# EAGLE design H05R0 (EAGLE 9.6.1)

## Sheet 1 of 3
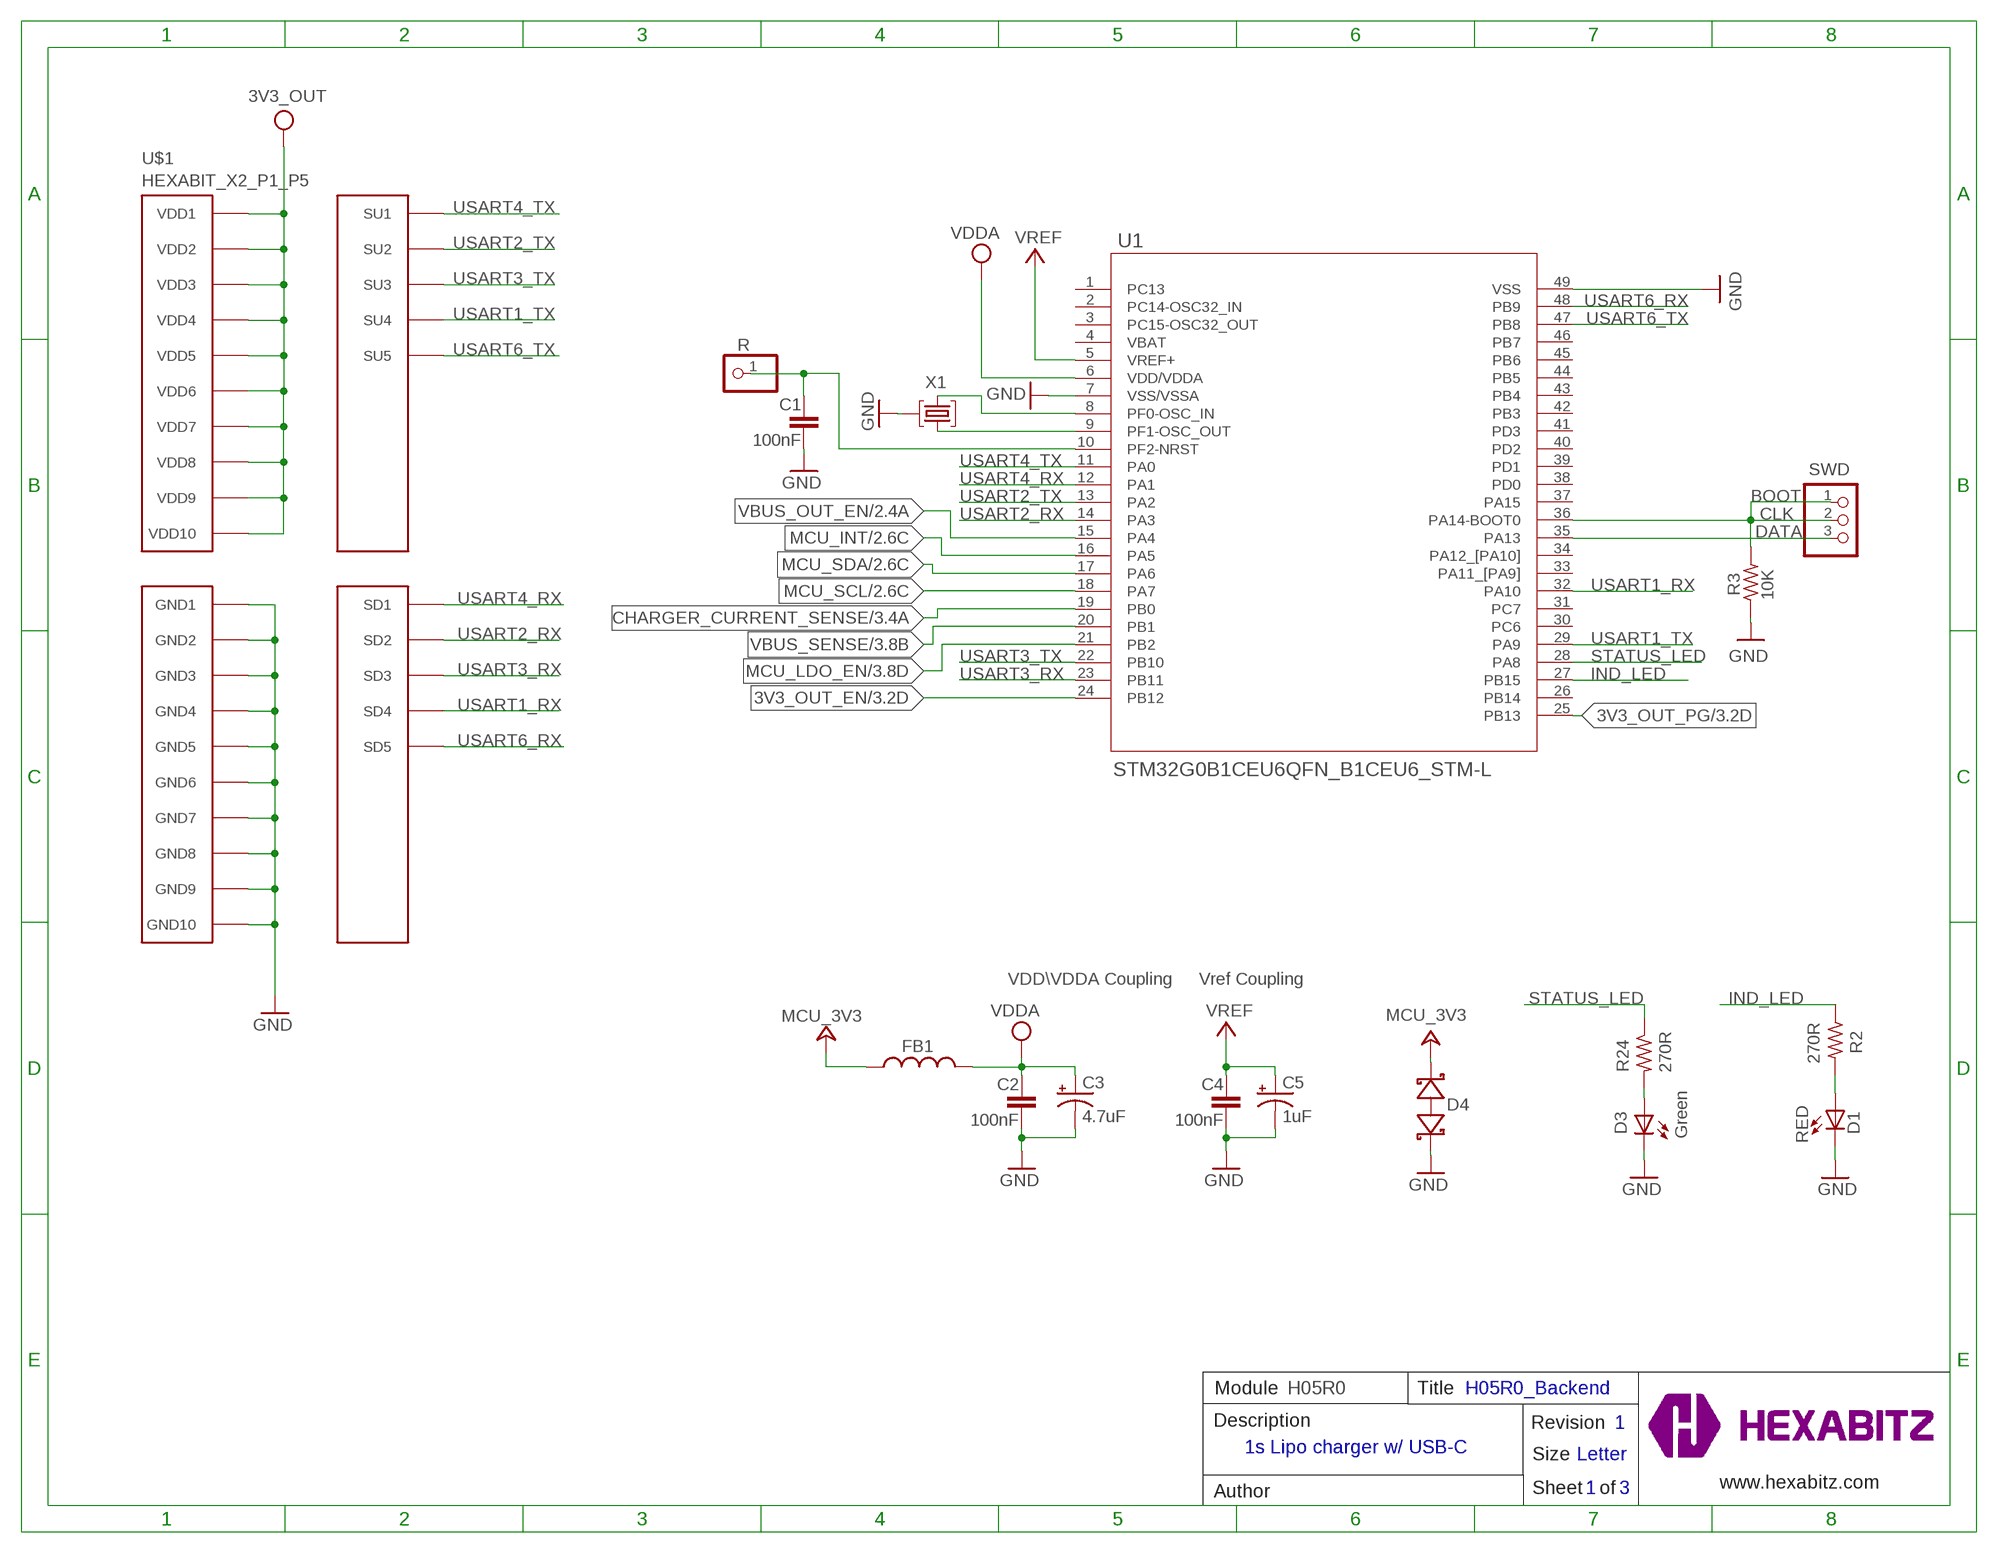
[diagram p0: schematic, sheet 1]

### Parts
C1  100nF  C-0603  [C-0603]
C2  100nF  C-0603  [C-0603]
C3  4.7uF  C-0805-POL  [C-0805-POL]
C4  100nF  C-0603  [C-0603]
C5  1uF  C-0805-POL  [C-0805-POL]
D1  RED  VLMS1300-GS08  [VLMS1300-GS08]
D3  Green  VLMTG1300-GS08  [VLMTG1300-GS08]
D4  BOURNS_CDSOD323-T03SCBOURNS_CDSOD323-T03SC_0_0  [BOURNS_CDSOD323-T03SC_0]
FB1  FB-0603  [FB-0603]
R  R  PINHD-1X1  [1X01]
R2  270R  R-0603  [R-0603]
R3  10K  R-0603  [R-0603]
R24  270R  R-0603  [R-0603]
SWD  PINHD-1X3  [1X03]
TRIMBLE-LOGO1  HEXA-LOGO  [HEXA-LOGO]
U1  STM32G0B1CEU6QFN_B1CEU6_STM-L  [QFN_B1CEU6_STM-L]
U$1  HEXABIT_X2_P1_P5  [HEXABIT_17.32_X2_P1_P5]
X1  XTALL_CSTCE8M00G52  [XTALL_CSTCE8M00G52]

### Nets
3V3_OUT: U$1.PAD_PU11(VDD1) U$1.PAD_PU12(VDD2) U$1.PAD_PU13(VDD3) U$1.PAD_PU14(VDD4) U$1.PAD_PU15(VDD5) U$1.PAD_PU16(VDD6) U$1.PAD_PU17(VDD7) U$1.PAD_PU18(VDD8) U$1.PAD_PU19(VDD9) U$1.PAD_PU20(VDD10) ; also sheet 3
3V3_OUT_EN: U1.24(PB12) ; also sheet 3
3V3_OUT_PG: U1.25(PB13) ; also sheet 3
CHARGER_CURRENT_SENSE: U1.19(PB0) ; also sheet 3
CLK: R3.2 SWD.1 SWD.2 U1.36(PA14-BOOT0)
DATA: SWD.3 U1.35(PA13)
GND: C1.2 C2.2 C3.2(-) C4.2 C5.2(-) D1.C D3.C D4.1(A) R3.1 U1.7(VSS/VSSA) U1.49(VSS) U$1.PAD_PD11(GND1) U$1.PAD_PD12(GND2) U$1.PAD_PD13(GND3) U$1.PAD_PD14(GND4) U$1.PAD_PD15(GND5) U$1.PAD_PD16(GND6) U$1.PAD_PD17(GND7) U$1.PAD_PD18(GND8) U$1.PAD_PD19(GND9) U$1.PAD_PD20(GND10) X1.P$2 ; also sheet 2,3
IND_LED: R2.1 U1.27(PB15)
MCU_3V3: D4.2(C) FB1.2 ; also sheet 2,3
MCU_INT: U1.16(PA5) ; also sheet 2
MCU_LDO_EN: U1.21(PB2) ; also sheet 3
MCU_SCL: U1.18(PA7) ; also sheet 2
MCU_SDA: U1.17(PA6) ; also sheet 2
N$1: D1.A R2.2
N$3: D3.A R24.2
N$5: U1.9(PF1-OSC_OUT) X1.P$1
N$6: U1.8(PF0-OSC_IN) X1.P$3
N$8: C1.1 R.1 U1.10(PF2-NRST)
STATUS_LED: R24.1 U1.28(PA8)
USART1_RX: U1.32(PA10) U$1.PAD_PD4(SD4)
USART1_TX: U1.29(PA9) U$1.PAD_PU4(SU4)
USART2_RX: U1.14(PA3) U$1.PAD_PD2(SD2)
USART2_TX: U1.13(PA2) U$1.PAD_PU2(SU2)
USART3_RX: U1.23(PB11) U$1.PAD_PD3(SD3)
USART3_TX: U1.22(PB10) U$1.PAD_PU3(SU3)
USART4_RX: U1.12(PA1) U$1.PAD_PD1(SD1)
USART4_TX: U1.11(PA0) U$1.PAD_PU1(SU1)
USART6_RX: U1.48(PB9) U$1.PAD_PD5(SD5)
USART6_TX: U1.47(PB8) U$1.PAD_PU5(SU5)
VBUS_OUT_EN: U1.15(PA4) ; also sheet 2
VBUS_SENSE: U1.20(PB1) ; also sheet 3
VDDA: C2.1 C3.1(+) FB1.1 U1.6(VDD/VDDA)
VREF: C4.1 C5.1(+) U1.5(VREF+)
Unconnected: U1.1(PC13) U1.2(PC14-OSC32_IN) U1.3(PC15-OSC32_OUT) U1.4(VBAT) U1.26(PB14) U1.30(PC6) U1.31(PC7) U1.33(PA11_[PA9]) U1.34(PA12_[PA10]) U1.37(PA15) U1.38(PD0) U1.39(PD1) U1.40(PD2) U1.41(PD3) U1.42(PB3) U1.43(PB4) U1.44(PB5) U1.45(PB6) U1.46(PB7)

### Notes on the sheet
- BOOT
- VDD\VDDA Coupling | Vref Coupling
- Module | H05R0 | Title | H05R0_Backend
- Description | Revision | 1
- 1s Lipo charger w/ USB-C
- Size | Letter
- www.hexabitz.com
- Author | Sheet   of | 1 | 3
- C:/Users/Admin/Desktop/logodraft.bmp

## Sheet 2 of 3
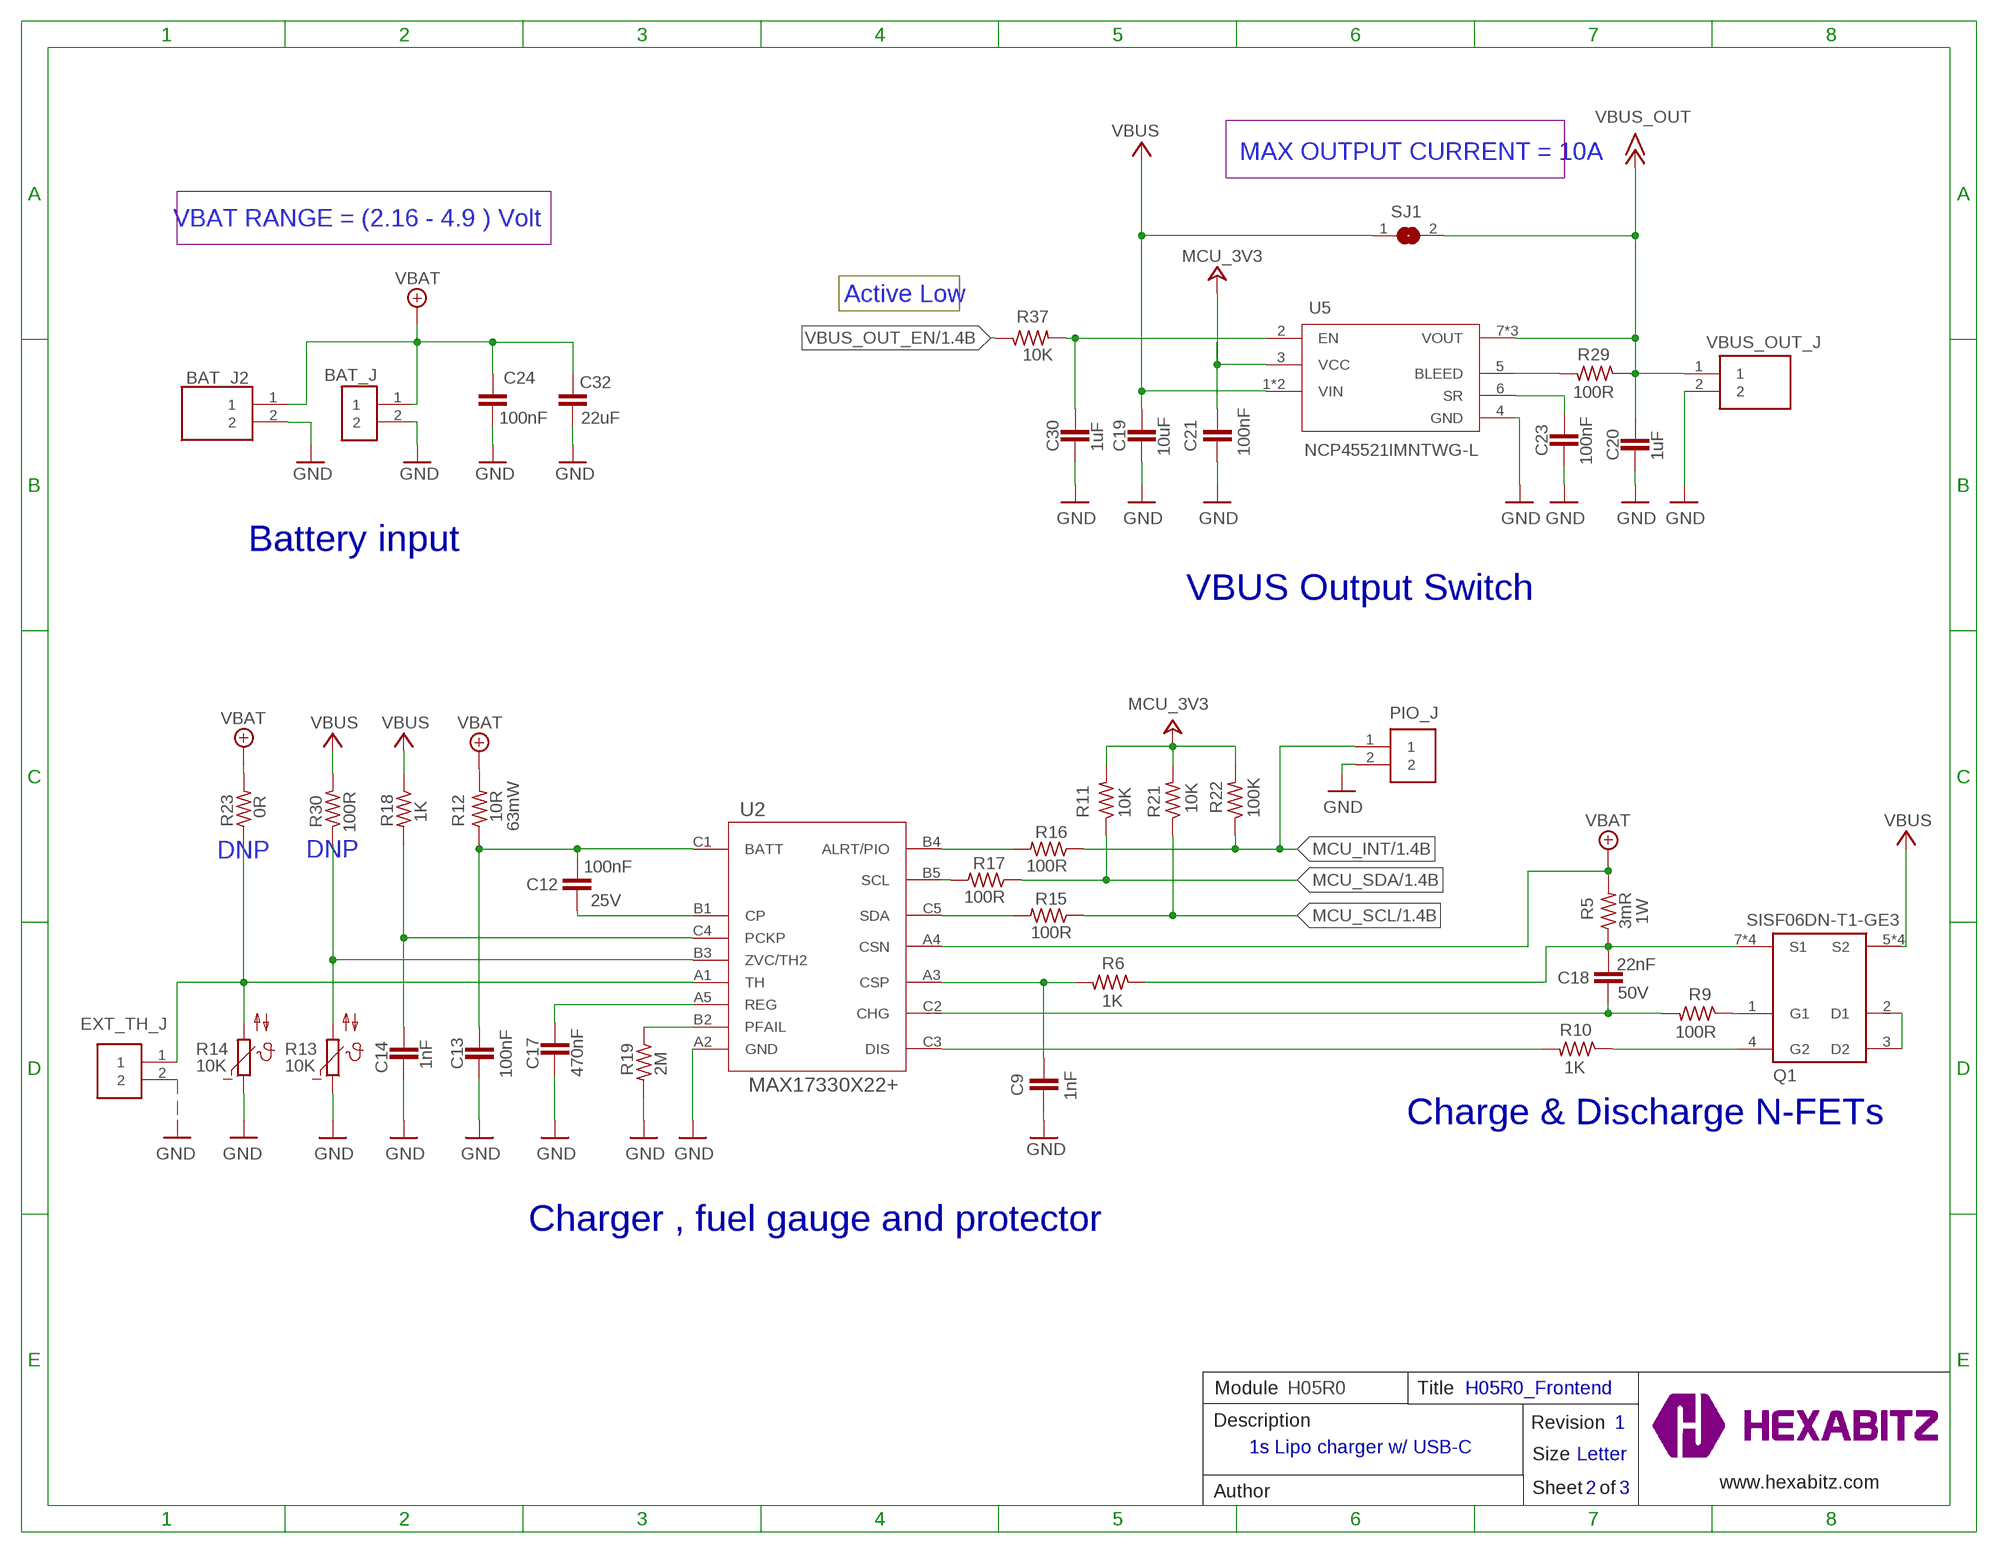
[diagram p1: schematic, sheet 2]

### Parts
BAT_J  B2B-PH-K-S(LF)(SN)  [JST_B2B-PH-K-S(LF)(SN)]
BAT_J2  B2P-VH-FB-B_LF__SN_  [B2PVHFBBLFSN]
C9  1nF  C-0603  [C-0603]
C12  100nF  C-0603  [C-0603]
C13  100nF  C-0603  [C-0603]
C14  1nF  C-0603  [C-0603]
C17  470nF  C-0603  [C-0603]
C18  22nF  C-0603  [C-0603]
C19  10uF  C-0805  [C-0805]
C20  1uF  C-0805  [C-0805]
C21  100nF  C-0603  [C-0603]
C23  100nF  C-0603  [C-0603]
C24  100nF  C-0603  [C-0603]
C30  1uF  C-0805  [C-0805]
C32  22uF  C-0805  [C-0805]
EXT_TH_J  3-644456-2  [TE_3-644456-2]
PIO_J  3-644456-2  [TE_3-644456-2]
Q1  SISF06DN-T1-GE3  [SISF06DNT1GE3]
R5  3mR  R_1206R1206  [R1206]
R6  1K  R-0603  [R-0603]
R9  100R  R-0603  [R-0603]
R10  1K  R-0603  [R-0603]
R11  10K  R-0603  [R-0603]
R12  10R  R-0603  [R-0603]
R13  10K  NCP18XH103F03RBNCP18XH103F03RB  [R-0603]
R14  10K  NCP18XH103F03RBNCP18XH103F03RB  [R-0603]
R15  100R  R-0603  [R-0603]
R16  100R  R-0603  [R-0603]
R17  100R  R-0603  [R-0603]
R18  1K  R-0603  [R-0603]
R19  2M  R-0603  [R-0603]
R21  10K  R-0603  [R-0603]
R22  100K  R-0603  [R-0603]
R23  DNP  R-0603  [R-0603]
R29  100R  R-0603  [R-0603]
R30  100R  R-0603  [R-0603]
R37  10K  R-0603  [R-0603]
SJ1  SJ  [SJ]
U2  MAX17330X22+  MAX17330X22+21-100433_W151J2+1_MXM  [21-100433_W151J2+1_MXM]
U5  NCP45521IMNTWG-L  NCP45521IMNTWG-LDFN8_2X2_ONS  [DFN8_2X2_ONS]
VBUS_OUT_J  1984617  [1984617]

### Nets
GND: BAT_J2.2 BAT_J.2 C9.1 C13.2 C14.2 C17.1 C19.2 C20.2 C21.1 C23.1 C24.1 C30.1 C32.2 EXT_TH_J.2 PIO_J.2 R13.1 R14.1 R19.2 U2.A2(GND) U5.4(GND) VBUS_OUT_J.2 ; also sheet 1,3
MCU_3V3: C21.2 R11.2 R21.2 R22.2 U5.3(VCC) ; also sheet 1,3
MCU_INT: PIO_J.1 R16.1 R22.1 ; also sheet 1
MCU_SCL: R15.1 R21.1 ; also sheet 1
MCU_SDA: R11.1 R17.1 ; also sheet 1
N$4: C30.2 R37.2 U5.2(EN)
N$7: R19.1 U2.B2(PFAIL)
N$9: C18.2 R9.2 U2.C2(CHG)
N$10: Q1.4(G2) R10.1
N$11: C9.2 R6.2 U2.A3(CSP)
N$12: C18.1 Q1.7(S1) Q1.8(S1) Q1.9(S1) Q1.11(S1) R5.1 R6.1
N$13: Q1.2(D1) Q1.3(D2)
N$15: R16.2 U2.B4(ALRT/PIO)
N$16: R17.2 U2.B5(SCL)
N$17: R13.2 R30.1 U2.B3(ZVC/TH2)
N$18: R10.2 U2.C3(DIS)
N$19: C17.2 U2.A5(REG)
N$20: C12.1 U2.B1(CP)
N$21: C12.2 C13.1 R12.1 U2.C1(BATT)
N$23: R29.2 U5.5(BLEED)
N$24: R15.2 U2.C5(SDA)
N$25: Q1.1(G1) R9.1
N$26: C14.1 R18.2 U2.C4(PCKP)
N$28: EXT_TH_J.1 R14.2 R23.1 U2.A1(TH)
N$29: C23.2 U5.6(SR)
VBAT: BAT_J2.1 BAT_J.1 C24.2 C32.1 R5.2 R12.2 R23.2 U2.A4(CSN)
VBUS: C19.1 Q1.5(S2) Q1.6(S2) Q1.10(S2) Q1.12(S2) R18.1 R30.2 SJ1.1 U5.1(VIN) U5.9(VIN) ; also sheet 3
VBUS_OUT: C20.1 R29.1 SJ1.2 U5.7(VOUT) U5.8(VOUT) U5.10(VOUT) VBUS_OUT_J.1
VBUS_OUT_EN: R37.1 ; also sheet 1

### Notes on the sheet
- MAX OUTPUT CURRENT = 10A
- VBAT RANGE = (2.16 - 4.9 ) Volt
- Active Low
- Battery input
- VBUS Output Switch
- Charge & Discharge N-FETs
- Charger , fuel gauge and protector
- Module | H05R0 | Title | H05R0_Frontend
- Description | Revision | 1
- 1s Lipo charger w/ USB-C
- Size | Letter
- www.hexabitz.com
- Author | Sheet   of | 2 | 3

## Sheet 3 of 3
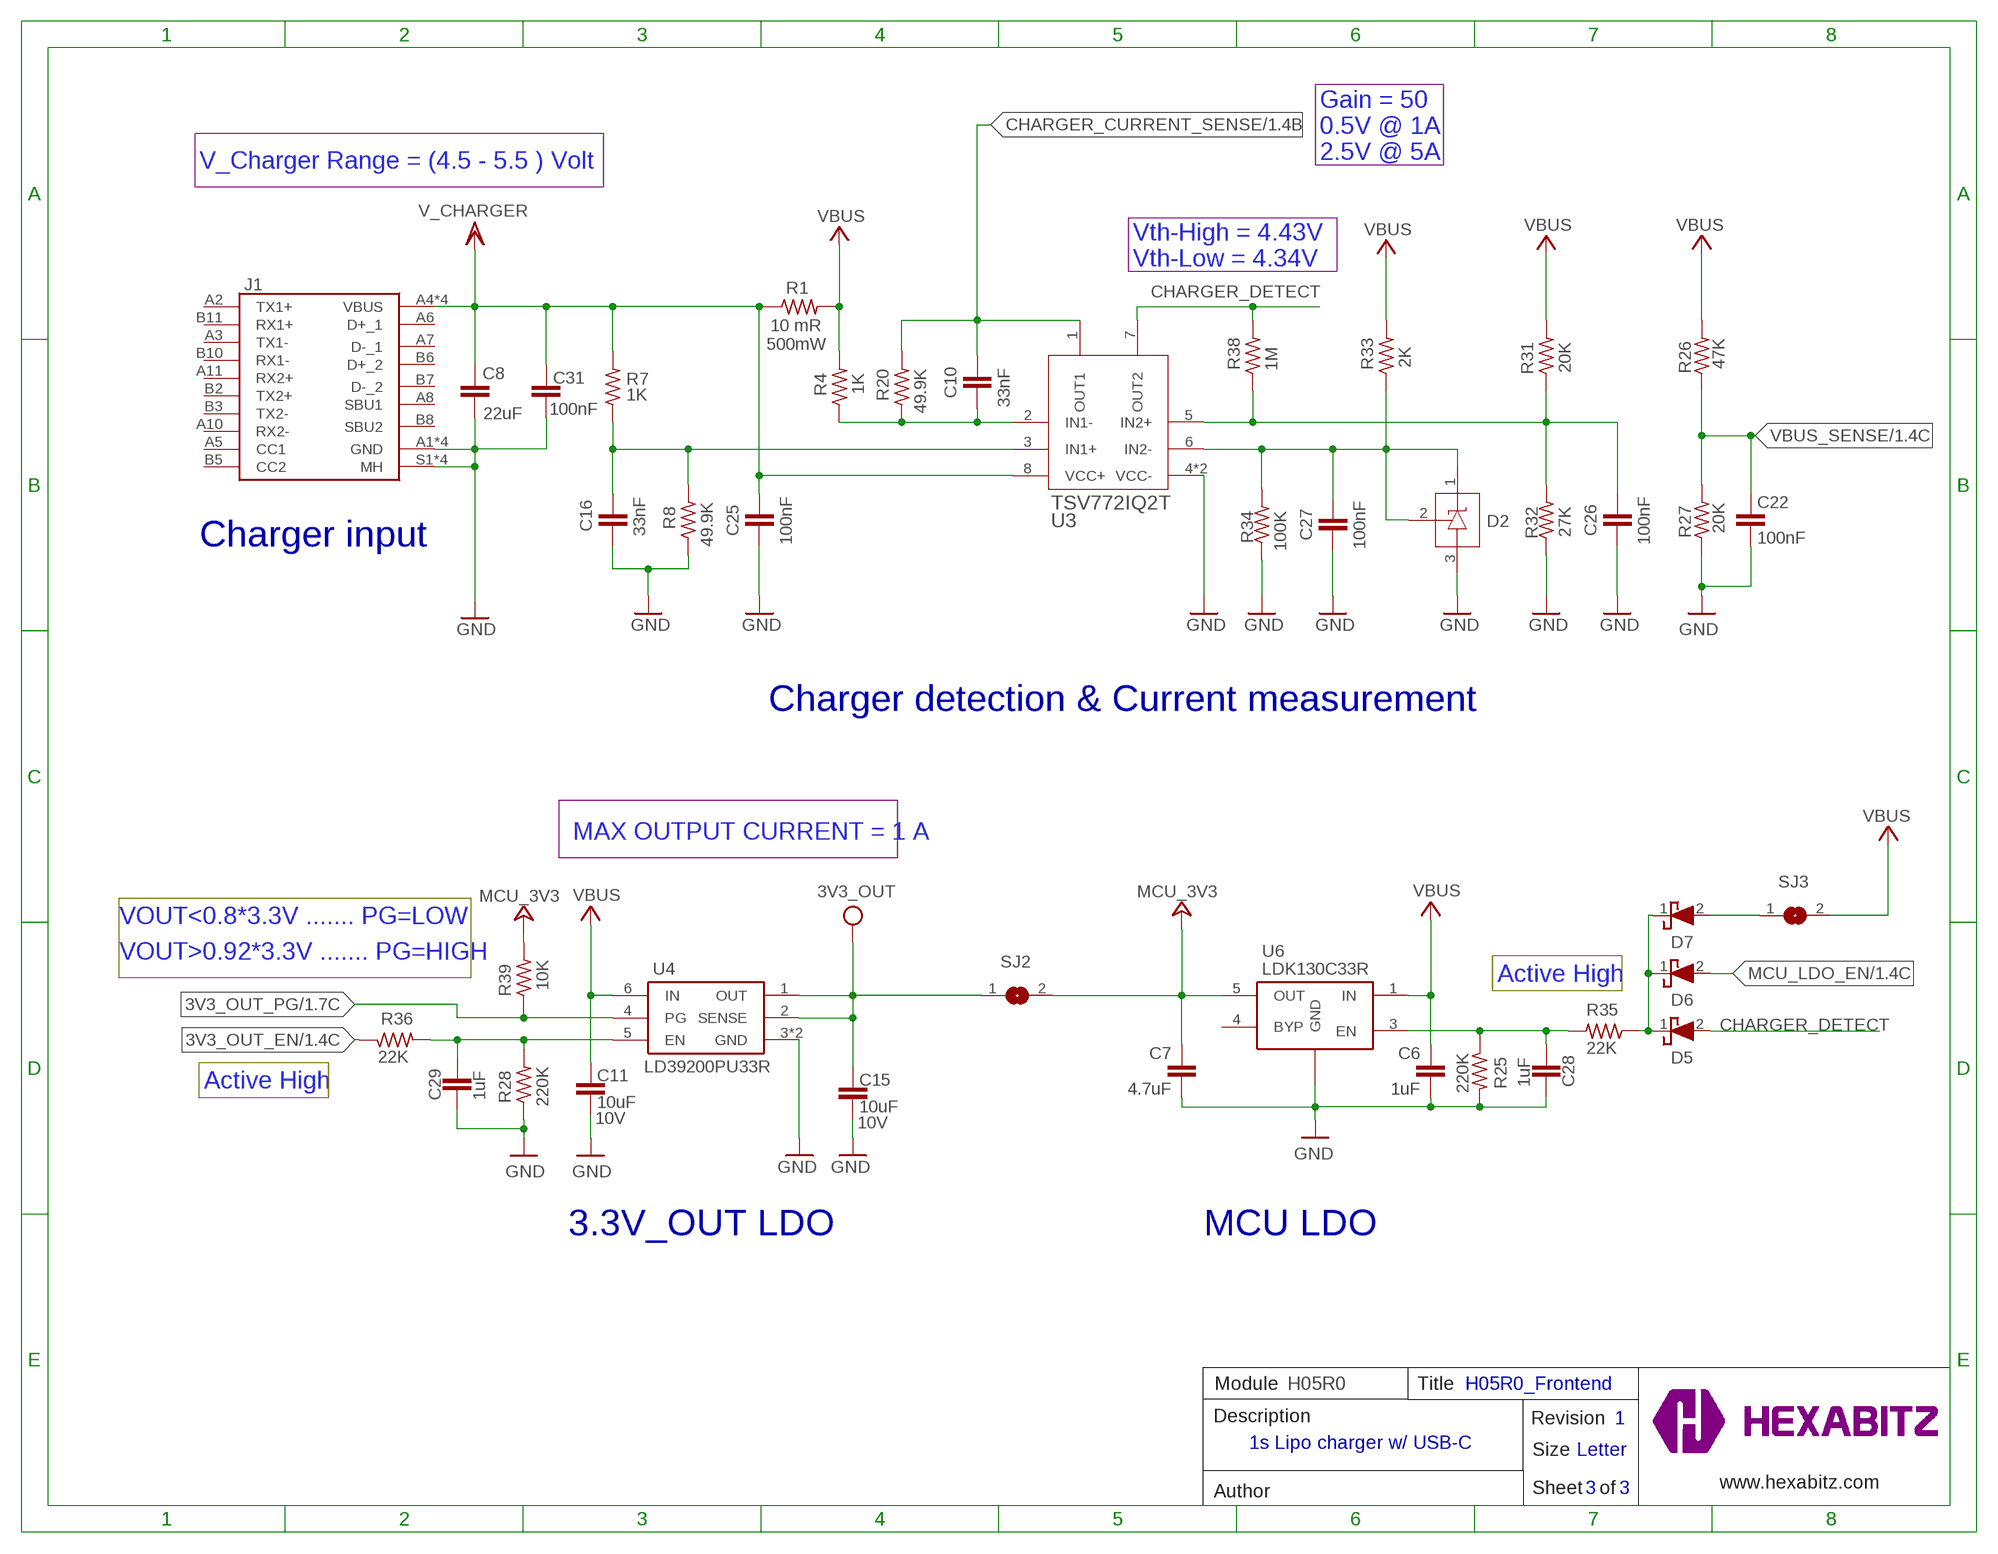
[diagram p2: schematic, sheet 3]

### Parts
C6  1uF  C-0805  [C-0805]
C7  4.7uF  C-0805  [C-0805]
C8  22uF  C-0805  [C-0805]
C10  33nF  C-0603  [C-0603]
C11  10uF  C-0805  [C-0805]
C15  10uF  C-0805  [C-0805]
C16  33nF  C-0603  [C-0603]
C22  100nF  C-0603  [C-0603]
C25  100nF  C-0603  [C-0603]
C26  100nF  C-0603  [C-0603]
C27  100nF  C-0603  [C-0603]
C28  1uF  C-0805  [C-0805]
C29  1uF  C-0805  [C-0805]
C31  100nF  C-0603  [C-0603]
D2  TL431QDBZR,215  [SOT23_TO-236AB_NEX]
D5  CUS10S30,H3F  [1SS357TPH3F]
D6  CUS10S30,H3F  [1SS357TPH3F]
D7  CUS10S30,H3F  [1SS357TPH3F]
J1  12401610E4#2A12401610E42A  [AMPHENOL_12401610E4_2A]
R1  10 mR  R-0805  [R-0805]
R4  1K  R-0603  [R-0603]
R7  1K  R-0603  [R-0603]
R8  49.9K  R-0603  [R-0603]
R20  49.9K  R-0603  [R-0603]
R25  220K  R-0603  [R-0603]
R26  47K  R-0603  [R-0603]
R27  20K  R-0603  [R-0603]
R28  220K  R-0603  [R-0603]
R31  20K  R-0603  [R-0603]
R32  27K  R-0603  [R-0603]
R33  2K  R-0603  [R-0603]
R34  100K  R-0603  [R-0603]
R35  22K  R-0603  [R-0603]
R36  22K  R-0603  [R-0603]
R38  1M  R-0603  [R-0603]
R39  10K  R-0603  [R-0603]
SJ2  SJ  [SJ]
SJ3  SJ  [SJ]
U3  TSV772IQ2T  [SON50P200X200X60-9N]
U4  LD39200PU33R  [SON95P300X300X100-7N]
U6  LDK130C33R  [SOT65P210X110-5N]

### Nets
3V3_OUT: C15.2 SJ2.1 U4.1(OUT) U4.2(SENSE) ; also sheet 1
3V3_OUT_EN: R36.1 ; also sheet 1
3V3_OUT_PG: R39.1 U4.4(PG) ; also sheet 1
CHARGER_CURRENT_SENSE: C10.2 R20.2 U3.1(OUT1) ; also sheet 1
CHARGER_DETECT: D5.2(A) R38.2 U3.7(OUT2)
GND: C6.2 C7.2 C8.2 C11.1 C15.1 C16.1 C22.2 C25.1 C26.1 C27.1 C28.1 C29.1 C31.1 D2.3 J1.A1(GND) J1.A12(GND) J1.B1(GND) J1.B12(GND) J1.S1(MH) J1.S2(MH) J1.S3(MH) J1.S4(MH) R8.1 R25.2 R27.1 R28.1 R32.1 R34.1 U3.4(VCC-) U3.9(VCC-) U4.3(GND) U4.7(GND) U6.2(GND) ; also sheet 1,2
MCU_3V3: C7.1 R39.2 SJ2.2 U6.5(OUT) ; also sheet 1,2
MCU_LDO_EN: D6.2(A) ; also sheet 1
N$14: C10.1 R4.1 R20.1 U3.2(IN1-)
N$22: C28.2 R25.1 R35.2 U6.3(EN)
N$27: C16.2 R7.1 R8.2 U3.3(IN1+)
N$30: C29.2 R28.2 R36.2 U4.5(EN)
N$32: D5.1(K) D6.1(K) D7.1(K) R35.1
N$35: D7.2(A) SJ3.1
VBUS: C6.1 C11.2 R1.2 R4.2 R26.2 R31.2 R33.2 SJ3.2 U4.6(IN) U6.1(IN) ; also sheet 2
VBUS1: C26.2 R31.1 R32.2 R38.1 U3.5(IN2+)
VBUS2: C27.2 D2.1 D2.2 R33.1 R34.2 U3.6(IN2-)
VBUS_SENSE: C22.1 R26.1 R27.2 ; also sheet 1
VCHARGER: C8.1 C25.2 C31.2 J1.A4(VBUS) J1.A9(VBUS) J1.B4(VBUS) J1.B9(VBUS) R1.1 R7.2 U3.8(VCC+) ; supply symbol labelled V_CHARGER
Unconnected: J1.A2(TX1+) J1.A3(TX1-) J1.A5(CC1) J1.A6(D+_1) J1.A7(D-_1) J1.A8(SBU1) J1.A10(RX2-) J1.A11(RX2+) J1.B2(TX2+) J1.B3(TX2-) J1.B5(CC2) J1.B6(D+_2) J1.B7(D-_2) J1.B8(SBU2) J1.B10(RX1-) J1.B11(RX1+) U6.4(BYP)

### Notes on the sheet
- Gain = 50
  0.5V @ 1A
  2.5V @ 5A
- V_Charger Range = (4.5 - 5.5 ) Volt
- Vth-High = 4.43V
  Vth-Low = 4.34V
- Charger input
- Charger detection & Current measurement
- MAX OUTPUT CURRENT = 1 A
- VOUT<0.8*3.3V ....... PG=LOW
- VOUT>0.92*3.3V ....... PG=HIGH
- Active High
- Active High
- 3.3V_OUT LDO | MCU LDO
- Module | H05R0 | Title | H05R0_Frontend
- Description | Revision | 1
- 1s Lipo charger w/ USB-C
- Size | Letter
- www.hexabitz.com
- Author | Sheet   of | 3 | 3
- C:/Users/Admin/Desktop/logodraft.bmp

## Library data of the parts
BAT_J = HEXABITZ_CONNECTION_PARTS:B2B-PH-K-S(LF)(SN): PH Series 2 Position 2 mm Pitch Through Hole Top Entry Shrouded Header Check availability <https://pricing.snapeda.com/parts/B2B-PH-K-S%28LF%29%28SN%29/JST%20Sales/view-part?ref=eda>; AVAILABILITY: In Stock; DESCRIPTION: Connector Header Through Hole 2 position 0.079 (2.00mm); MF: JST Sales; MP: B2B-PH-K-S(LF)(SN); PACKAGE: None; PRICE: None; PURCHASE-URL: https://pricing.snapeda.com/search?q=B2B-PH-K-S(LF)(SN)&ref=eda
BAT_J2 = HEXABITZ_CONNECTION_PARTS:B2P-VH-FB-B_LF__SN_: 2 Positions Header Connector 0.156" (3.96mm) Through Hole Tin Source: Datasheet <http://www.jst-mfg.com/product/pdf/eng/eVH.pdf>; DESCRIPTION: 2 Positions Header Connector 0.156" (3.96mm) Through Hole Tin; HEIGHT: 11mm; MANUFACTURER_NAME: JST (JAPAN SOLDERLESS TERMINALS); MANUFACTURER_PART_NUMBER: B2P-VH-FB-B(LF)(SN)
C1 C2 C4 = HEXABITZ_RCLS:C-0603: CAP CER 10% X7R 0603
C3 C5 = HEXABITZ_RCLS:C-0805-POL: Cap Tant Solid SMD 2012
C6-C8 C19 C20 C32 = HEXABITZ_RCLS:C-0805: CAP CER 10% X7R 0805
C9 C10 C14 C16 C18 C22 C24-C27 C31 = HEXABITZ_RCLS:C-0603: CAP CER 10% X7R 0603; VOLTAGE_RATING: 50V
C11 C15 C28-C30 = HEXABITZ_RCLS:C-0805: CAP CER 10% X7R 0805; MPN: GRM187R61A226ME15; VOLTAGE_RATING: 10V
C12 = HEXABITZ_RCLS:C-0603: CAP CER 10% X7R 0603; VOLTAGE_RATING: 25V
C13 C17 = HEXABITZ_RCLS:C-0603: CAP CER 10% X7R 0603; VOLTAGE_RATING: 10V
C21 C23 = HEXABITZ_RCLS:C-0603: CAP CER 10% X7R 0603; MPN: GRM187R61A226ME15; VOLTAGE_RATING: 10V
D1 = HEXABITZ_USER_INTERFACE_PARTS:VLMS1300-GS08: Red 0603 130° Clear 54 mcd 2 V Surface Mount ChipLED ; Octopart Url : http://octopart.com/vlms1300-gs08-vishay-21709201; MFN: Vishay; MPN: VLMS1300-GS08; OCTOPART_URL: https://octopart.com/vlms1300-gs08-vishay-21709201?r=sp&s=_gcP4_q8T1SC6PJQPTQ9yA
D2 = HEXABITZ_RCLS:TL431QDBZR,215; COPYRIGHT: Copyright (C) 2022 Ultra Librarian. All rights reserved.; MANUFACTURER_PART_NUMBER: TS2431BILT; MFR_NAME: Nexperia
D3 = HEXABITZ_USER_INTERFACE_PARTS:VLMTG1300-GS08: LED Uni-Color Green 530nm 2-Pin Chip 0603(1608Metric) T/R; MFN: Vishay; MPN: VLMS1300-GS08; OCTOPART_URL: https://octopart.com/vlms1300-gs08-vishay-21709201?r=sp&s=_gcP4_q8T1SC6PJQPTQ9yA
D4 = HEXABITZ_RCLS:BOURNS_CDSOD323-T03SC: CDSOD323-TxxSC - TVS Diode Series; DESCRIPTION: Dio Tvs Vwm 03V 500W Bidir Sod323 / Tape & Reel - 7" Reel; MFN: Bourns; MPN: CDSOD323-T03SC; OCTOPART_URL: https://octopart.com/cdsod323-t03sc-bourns-10487153?r=sp
D5-D7 = HEXABITZ_RCLS:CUS10S30,H3F: Schottky Diodes & Rectifiers Single High-speed switching Source: Datasheet <http://toshiba.semicon-storage.com/info/docget.jsp?did=14077&prodName=CUS10S30>; ARROW_PART_NUMBER: CUS10S30,H3F; ARROW_PRICE-STOCK: https://www.arrow.com/en/products/cus10s30h3f/toshiba?region=nac; DESCRIPTION: Schottky Diodes & Rectifiers Single High-speed switching; HEIGHT: 1mm; MANUFACTURER_NAME: Toshiba; MANUFACTURER_PART_NUMBER: CUS10S30,H3F; MOUSER_PART_NUMBER: 757-CUS10S30H3F; MOUSER_PRICE-STOCK: https://www.mouser.co.uk/ProductDetail/Toshiba/CUS10S30H3F?qs=cW4DzVrAanO4Xm6ySrHr7g%3D%3D
EXT_TH_J PIO_J = HEXABITZ_USER_INTERFACE_PARTS:3-644456-2; AVAILABILITY: Unavailable; CENTERLINE_PITCH: 2.54 mm[.1 in]; COMMENT: 3-644456-2; DESCRIPTION: Connector Unshrouded Header HDR 2 Position 2.54mm Solder Straight Thru-Hole; EU_ROHS_COMPLIANCE: Compliant; MF: TE Connectivity; MFN: TE Connectivity; MP: 3-644456-2; MPN: 87224-1; NUMBER_OF_POSITIONS: 2; OCTOPART_URL: https://octopart.com/87224-1-te+connectivity-39512011?r=sp; PACKAGE: None; PRICE: None; PRODUCT_TYPE: Connector; TE_PURCHASE_URL: https://www.te.com/usa-en/product-3-644456-2.html?te_bu=Cor&te_type=disp&te_campaign=seda_glo_cor-seda-global-disp-prtnr-fy19-seda-model-bom-cta_sma-317_1&elqCampaignId=32493
FB1 = HEXABITZ_RCLS:FB-0603: Ferrite Beads Multi-Layer 0603
J1 = HEXABITZ_CONNECTION_PARTS:12401610E4#2A: USB3.2 GEN2, Type C, Top mount, CH 1.58mm, Dual Row SMT Source: Datasheet <https://cdn.amphenol-cs.com/media/wysiwyg/files/drawing/c12401610_c.pdf>
Q1 = HEXABITZ_ICs:SISF06DN-T1-GE3: 1-MOSFET Dual N-Ch 30V(S1-S2) Source: Datasheet <https://www.vishay.com/docs/77407/sisf06dn.pdf>; DESCRIPTION: 1-MOSFET Dual N-Ch 30V(S1-S2); HEIGHT: 0.8mm; MANUFACTURER_NAME: Vishay; MANUFACTURER_PART_NUMBER: SISF06DN-T1-GE3; MOUSER_PART_NUMBER: 78-SISF06DN-T1-GE3; MOUSER_PRICE-STOCK: https://www.mouser.co.uk/ProductDetail/Vishay-Siliconix/SISF06DN-T1-GE3?qs=vmHwEFxEFR9s9AAsXqpgFQ%3D%3D
R = HEXABITZ_USER_INTERFACE_PARTS:PINHD-1X1: PIN HEADER; MFN: TE Connectivity; MPN: 87227-1; OCTOPART_URL: https://octopart.com/87227-1-te+connectivity-39512052?r=sp
R1 = HEXABITZ_RCLS:R-0805: Thick Film Resistors - SMD 0605; POWR: 500mW
R2 R3 R6 R9-R11 R15-R19 R21 R22 R24-R27 R29 R35-R37 = HEXABITZ_RCLS:R-0603: Thick Film Resistors - SMD 0603
R4 R7 R8 R20 R30-R34 R38 = HEXABITZ_RCLS:R-0603: Thick Film Resistors - SMD 0603; STATE: DNP
R5 = HEXABITZ_RCLS:R_1206: RESISTOR, American symbol; MFN: Stackpole Electronics; MPN: WFC12063L000FE66; OCTOPART_URL: https://www.digikey.com/en/products/detail/vishay-dale/WFC12063L000FE66/15908406; POWER: 1W
R12 = HEXABITZ_RCLS:R-0603: Thick Film Resistors - SMD 0603; POWER: 63mW
R13 R14 = HEXABITZ_RCLS:NCP18XH103F03RB: SIEMENS NTC; MPN: NCP18XH103F03RB
R23 = HEXABITZ_RCLS:R-0603: Thick Film Resistors - SMD 0603; RESISTANCE: 0R; STATE: DNP
R28 R39 = HEXABITZ_RCLS:R-0603: Thick Film Resistors - SMD 0603; TOLERANCE: 1%
SJ1-SJ3 = HEXABITZ_USER_INTERFACE_PARTS:SJ: SMD solder JUMPER
SWD = pinhead:PINHD-1X3: PIN HEADER
TRIMBLE-LOGO1 = HEXABITZ_USER_INTERFACE_PARTS:HEXA-LOGO: Trimble-Logo
U1 = HEXABITZ_ICs:STM32G0B1CEU6; COPYRIGHT: Copyright (C) 2021 Ultra Librarian. All rights reserved.; MANUFACTURER_PART_NUMBER: STM32G0B1CEU6; MFR_NAME: STMicroelectronics
U2 = HEXABITZ_ICs:MAX17330X22+; COPYRIGHT: Copyright (C) 2023 Ultra Librarian. All rights reserved.; MANUFACTURER_PART_NUMBER: MAX17330X22+; MFR_NAME: Analog Devices Inc
U3 = HEXABITZ_ICs:TSV772IQ2T: High bandwidth (20MHz) Low offset (200 µV) rail-to-rail 5V Op amp Source: Datasheet <https://www.st.com/resource/en/datasheet/tsv772.pdf>; DESCRIPTION: High bandwidth (20MHz) Low offset (200 &#181;V) rail-to-rail 5V Op amp; HEIGHT: 0.6mm; MANUFACTURER_NAME: STMicroelectronics; MANUFACTURER_PART_NUMBER: TSV772IQ2T; MOUSER_PART_NUMBER: 511-TSV772IQ2T; MOUSER_PRICE-STOCK: https://www.mouser.co.uk/ProductDetail/STMicroelectronics/TSV772IQ2T?qs=TCDPyi3sCW2%2FvOWyS3CZ7w%3D%3D
U4 = HEXABITZ_ICs:LD39200PU33R: LDO Voltage Regulators 2 A high PSRR ultra low drop linear regulator with reverse current protection Source: Datasheet <https://www.st.com/resource/en/datasheet/ld39200.pdf>; DESCRIPTION: LDO Voltage Regulators 2 A high PSRR ultra low drop linear regulator with reverse current protection; HEIGHT: 1mm; MANUFACTURER_NAME: STMicroelectronics; MANUFACTURER_PART_NUMBER: LD39200PU33R; MOUSER_PART_NUMBER: 511-LD39200PU33R; MOUSER_PRICE-STOCK: https://www.mouser.co.uk/ProductDetail/STMicroelectronics/LD39200PU33R?qs=WHlX%252B%252B9%2FRwAl6%2FJDqRS1uw%3D%3D
U5 = HEXABITZ_ICs:NCP45521IMNTWG-L; COPYRIGHT: Copyright (C) 2024 Ultra Librarian. All rights reserved.; MANUFACTURER_PART_NUMBER: NCP45521IMNTWG-L; MFR_NAME: onsemi
U6 = HEXABITZ_ICs:LDK130C33R: LDO Regulator Pos 3.3V 0.3A 5-Pin SOT-323 T/R Source: Datasheet <http://www.st.com/content/ccc/resource/technical/document/datasheet/29/10/f7/87/2f/66/47/f4/DM00076097.pdf/files/DM00076097.pdf/jcr:content/translations/en.DM00076097.pdf>; DESCRIPTION: LDO Regulator Pos 3.3V 0.3A 5-Pin SOT-323 T/R; HEIGHT: 1.1mm; MANUFACTURER_NAME: STMicroelectronics; MANUFACTURER_PART_NUMBER: LDK130C33R; MOUSER_PART_NUMBER: 511-LDK130C33R; MOUSER_PRICE-STOCK: https://www.mouser.co.uk/ProductDetail/STMicroelectronics/LDK130C33R?qs=WHlX%252B%252B9%2FRwCENF1z4ap3Hg%3D%3D
U$1 = hexabitz_connectors:HEXABIT_X2_P1_P5
VBUS_OUT_J = HEXABITZ_CONNECTION_PARTS:1984617: PCB terminal block, Nominal current: 17.5 A, Nom. voltage: 200 V, Pitch: 3.5 mm, Number of positions: 2, Connection method: Screw connection with wire protector, Mounting: Wave soldering, Conductor/PCB connection direction: 0 , Color: green Source: Datasheet <https://datasheet.datasheetarchive.com/originals/distributors/Datasheets-DGA17/1074867.pdf>; DESCRIPTION: PCB terminal block, Nominal current: 17.5 A, Nom. voltage: 200 V, Pitch: 3.5 mm, Number of positions: 2, Connection method: Screw connection with wire protector, Mounting: Wave soldering, Conductor/PCB connection direction: 0 , Color: green; HEIGHT: 9.3mm; MANUFACTURER_NAME: Phoenix Contact; MANUFACTURER_PART_NUMBER: 1984617; MOUSER_PART_NUMBER: 651-1984617; MOUSER_PRICE-STOCK: https://www.mouser.co.uk/ProductDetail/Phoenix-Contact/1984617?qs=ATjOrvm3mOhUrGlJQoUcpQ%3D%3D
X1 = Hexabitz:XTALL_CSTCE8M00G52: MURATA CSTCE8M00G52-R0 RESONATOR, SMD, 8MHZ ; Octopart Url : https://octopart.com/cstce8m00g52-r0-murata-7145559; MFN: Murata; MPN: CSTCE8M00G52Z-R0; OCTOPART_URL: https://octopart.com/cstce8m00g52z-r0-murata-17755941?r=sp&s=JDnNJnrHQhyS8Zk4ofFWXw

## Board
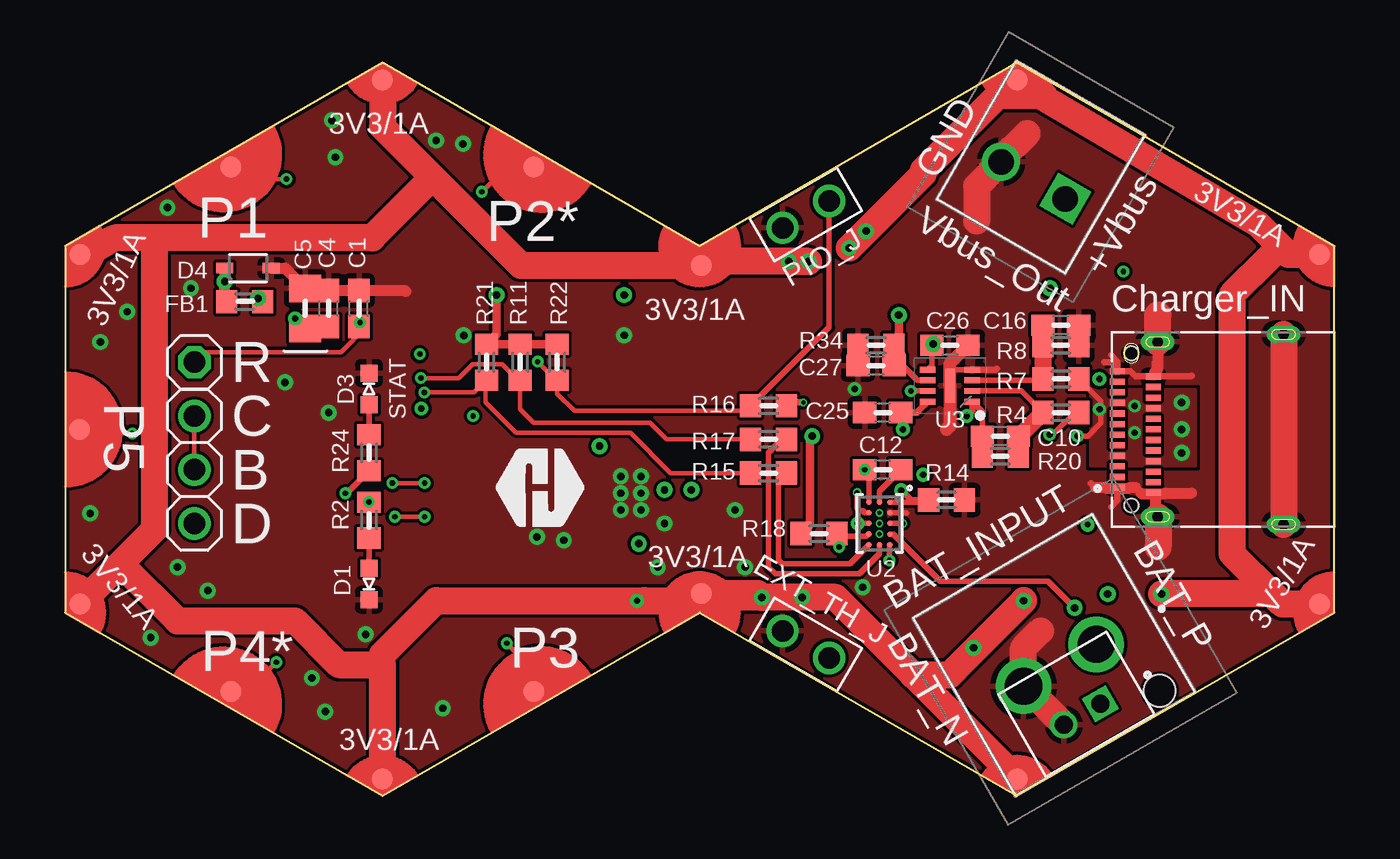
[diagram p3: board, top side]
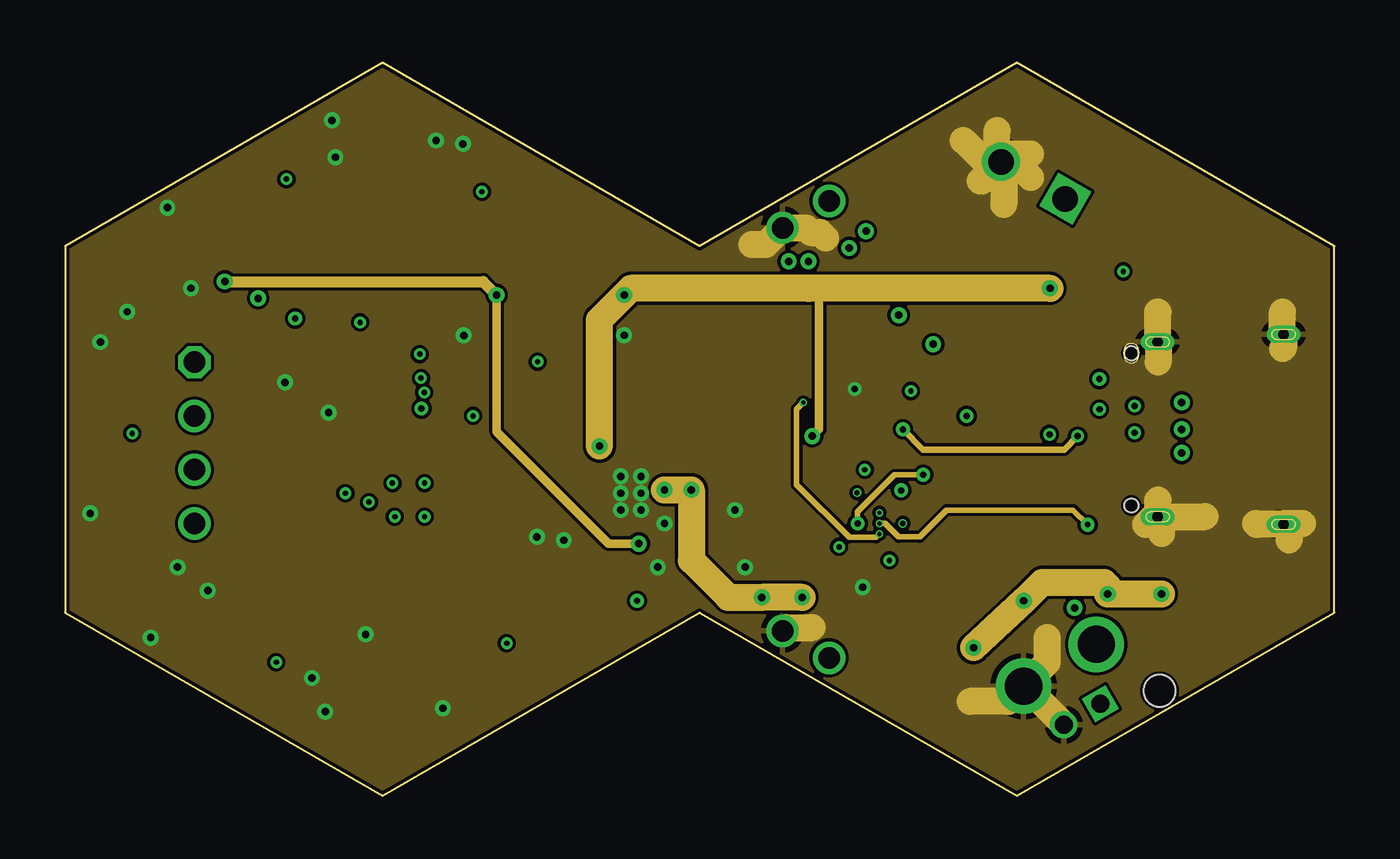
[diagram p4: board, inner layer Route2]
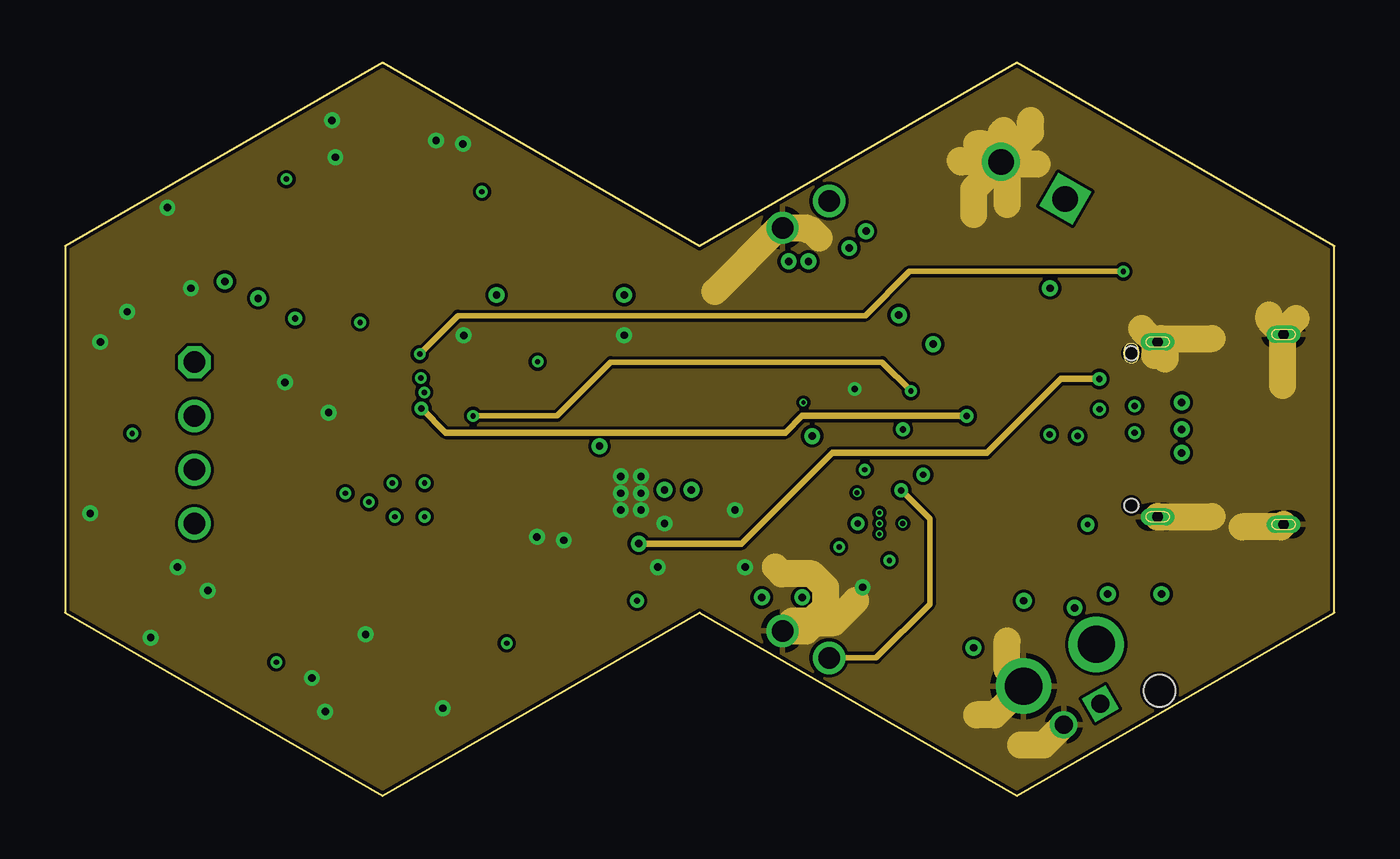
[diagram p5: board, inner layer Route15]
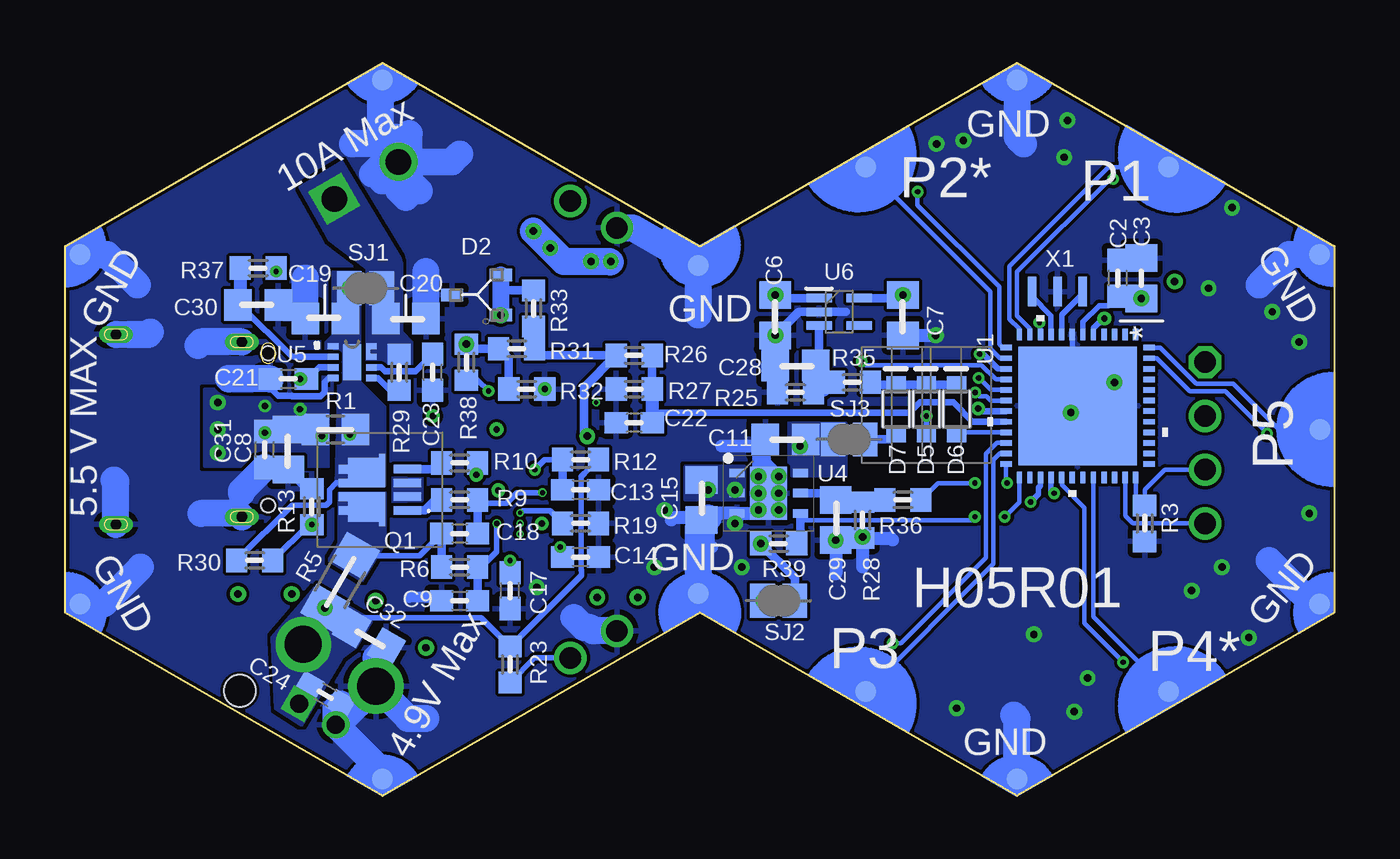
[diagram p6: board, bottom side, seen from below]

Size 60 x 34.64 mm. Coordinates in mm from the lower left corner, seen from the top.
Copper layers (1+2*15+16): Top 0.035mm / dielectric 1.5mm / Route2 0.035mm / dielectric 0.15mm / Route15 0.035mm / dielectric 0.2mm / Bottom 0.035mm
Design rules "default1 *": minimum track width 8mil, minimum drill 0.2mm, track to track 6mil, track to pad 6mil, pad to pad 6mil, via to via 5mil, smd to smd 0mil, copper to edge 6mil, drill to drill 6mil, minimum pad ring 6mil, minimum via ring 3mil, stop-mask expansion 4mil, vias tented up to drill 24mil, thermal gap 10mil

### Footprints (pad centres in the part's own frame; a part is rotated, then mirrored left to right if it is on the bottom)
JST_B2B-PH-K-S(LF)(SN) = drill 0.86 square: 1 1,-0.55 | drill 0.86: 2 -1,-0.55
B2PVHFBBLFSN = drill 1.75 pad 2.625: 1 0,0; 2 -3.96,0 | hole 1.5: 1.5,-3.4
C-0603 = smd 1.1 x 1: 1 -0.85,0; 2 0.85,0
C-0805-POL = smd 1.3 x 1.5: 1 -0.95,0; 2 0.95,0
C-0805 = smd 1.3 x 1.5: 1 -0.95,0; 2 0.95,0
VLMS1300-GS08 = smd 0.8 x 0.8: A 0,0.75; C 0,-0.75
SOT23_TO-236AB_NEX = smd 0.6 x 1.05: 1 -0.95,-1.15; 2 0.95,-1.15; 3 0,1.15
VLMTG1300-GS08 = smd 0.8 x 0.8: A 0,0.75; C 0,-0.75
BOURNS_CDSOD323-T03SC_0 = smd 0.8 x 0.5: 1 -1.1,0; 2 1.1,0
1SS357TPH3F = smd 0.9 x 0.8: 1 0,-1.15; 2 0,1.15
TE_3-644456-2 = drill 1.02 pad 1.37: 1 0,0; 2 2.54,0
FB-0603 = smd 1 x 1.1: 1 -0.85,0; 2 0.85,0
AMPHENOL_12401610E4_2A = smd 0.29 x 0.7: A1 -2.75,0.66; A2 -2.25,0.66; A3 -1.75,0.66; A4 -1.25,0.66; A5 -0.75,0.66; A6 -0.25,0.66; A7 0.25,0.66; A8 0.75,0.66; A9 1.25,0.66; A10 1.75,0.66; A11 2.25,0.66; A12 2.75,0.66; B1 2.5,-1.04; B2 2,-1.04; B3 1.5,-1.04; B4 1,-1.04; B5 0.5,-1.04; B6 0,-1.04; B7 -0.5,-1.04; B8 -1,-1.04; B9 -1.5,-1.04; B10 -2,-1.04; B11 -2.5,-1.04; B12 -3,-1.04 | drill 0.5 pad 0.8 long: S1 -4.13,-1.25; S2 4.13,-1.25; S3 4.49,-7.2; S4 -4.49,-7.2 | hole 0.65: -3.6,0; 3.6,0
SISF06DNT1GE3 = smd 1.29 x 0.4: 1 -1.342,0.975; 2 -1.342,0.325; 3 -1.342,-0.325; 4 -1.342,-0.975 | smd 0.46 x 0.42: 5 1.688,-0.975; 6 1.688,-0.325; 7 1.688,0.325; 8 1.688,0.975 | smd 1.76 x 1.39: 9 0.583,0.81; 10 0.583,-0.81 | smd 0.3 x 0.21: 11 -0.147,1.605; 12 -0.147,-1.605
1X01 = drill 1.016 octagon: 1 0,0
R-0805 = smd 1.3 x 1.5: 1 -0.95,0; 2 0.95,0
R-0603 = smd 1 x 1.1: 1 -0.85,0; 2 0.85,0
R1206 = smd 1.6 x 1.803: 1 -1.422,0; 2 1.422,0
SJ = smd 1.168 x 1.6: 1 -0.762,0; 2 0.762,0
1X03 = drill 1.016: 1 -2.54,0; 2 0,0; 3 2.54,0
QFN_B1CEU6_STM-L = smd 0.55 x 0.254: 1 -3.38,2.751; 2 -3.38,2.251; 3 -3.38,1.75; 4 -3.38,1.25; 5 -3.38,0.75; 6 -3.38,0.25; 7 -3.38,-0.25; 8 -3.38,-0.75; 9 -3.38,-1.25; 10 -3.38,-1.75; 11 -3.38,-2.251; 12 -3.38,-2.751; 25 3.38,-2.751; 26 3.38,-2.251; 27 3.38,-1.75; 28 3.38,-1.25; 29 3.38,-0.75; 30 3.38,-0.25; 31 3.38,0.25; 32 3.38,0.75; 33 3.38,1.25; 34 3.38,1.75; 35 3.38,2.251; 36 3.38,2.751 | smd 0.254 x 0.55: 13 -2.751,-3.38; 14 -2.251,-3.38; 15 -1.75,-3.38; 16 -1.25,-3.38; 17 -0.75,-3.38; 18 -0.25,-3.38; 19 0.25,-3.38; 20 0.75,-3.38; 21 1.25,-3.38; 22 1.75,-3.38; 23 2.251,-3.38; 24 2.751,-3.38; 37 2.751,3.38; 38 2.251,3.38; 39 1.75,3.38; 40 1.25,3.38; 41 0.75,3.38; 42 0.25,3.38; 43 -0.25,3.38; 44 -0.75,3.38; 45 -1.25,3.38; 46 -1.75,3.38; 47 -2.251,3.38; 48 -2.751,3.38 | smd 5.6 x 5.6: 49 0,0
21-100433_W151J2+1_MXM = smd 0.254 x 0.254: A1 -1,0.5; A2 -0.5,0.5; A3 0,0.5; A4 0.5,0.5; A5 1,0.5; B1 -1,0; B2 -0.5,0; B3 0,0; B4 0.5,0; B5 1,0; C1 -1,-0.5; C2 -0.5,-0.5; C3 0,-0.5; C4 0.5,-0.5; C5 1,-0.5
SON50P200X200X60-9N = smd 0.75 x 0.28: 1 -1.05,0.75; 2 -1.05,0.25; 3 -1.05,-0.25; 4 -1.05,-0.75; 5 1.05,-0.75; 6 1.05,-0.25; 7 1.05,0.25; 8 1.05,0.75 | smd 0.45 x 1.6: 9 0,0
SON95P300X300X100-7N = smd 0.7 x 0.4: 1 -1.5,0.95; 2 -1.5,0; 3 -1.5,-0.95; 4 1.5,-0.95; 5 1.5,0; 6 1.5,0.95 | smd 1.75 x 2.5: 7 0,0
DFN8_2X2_ONS = smd 0.5 x 0.29: 1 -0.9,0.75; 2 -0.9,0.25; 3 -0.9,-0.25; 4 -0.9,-0.75; 5 0.9,-0.75; 6 0.9,-0.25; 7 0.9,0.25; 8 0.9,0.75 | smd 0.87 x 1.7: 9 0,0 | smd 0.2 x 0.21: 10 0.75,0.5
SOT65P210X110-5N = smd 1.2 x 0.4: 1 -0.95,0.65; 2 -0.95,0; 3 -0.95,-0.65; 4 0.95,-0.65; 5 0.95,0.65
HEXABIT_17.32_X2_P1_P5 = smd 1 x 1 bottom: PAD_PD1 12.39,22.39; PAD_PD2 12.39,8.09; PAD_PD3 -12.39,8.09; PAD_PD4 -12.39,22.39; PAD_PD5 0,29.55; PAD_PD12 16.52,15.24; PAD_PD13 7.752,0.168; PAD_PD14 16.52,-14.76; PAD_PD15 8.26,-29.07; PAD_PD16 -8.26,-29.07; PAD_PD17 -16.52,-14.76; PAD_PD18 -7.752,0.168; PAD_PD19 -16.52,15.24 | smd 1 x 1 rotated 60 bottom: PAD_PD11 8.26,29.547 | smd 1 x 1 rotated 120 bottom: PAD_PD20 -8.26,29.547 | smd 1 x 1: PAD_PU1 12.39,22.39; PAD_PU2 12.39,8.09; PAD_PU3 -12.39,8.09; PAD_PU4 -12.39,22.39; PAD_PU5 0,29.55; PAD_PU12 16.52,15.24; PAD_PU13 7.752,0.168; PAD_PU14 16.52,-14.76; PAD_PU15 8.26,-29.07; PAD_PU16 -8.26,-29.07; PAD_PU17 -16.52,-14.76; PAD_PU18 -7.752,0.168; PAD_PU19 -16.52,15.24 | smd 1 x 1 rotated 60: PAD_PU11 8.26,29.547 | smd 1 x 1 rotated 120: PAD_PU20 -8.26,29.547
1984617 = drill 1.2 pad 1.8 square: 1 -1.753,0.711 | drill 1.2 pad 1.8: 2 1.747,0.711
XTALL_CSTCE8M00G52 = smd 1.4 x 0.4: P$1 0,1.2; P$2 0,0; P$3 0,-1.2

### Placement (x,y rotation side)
BAT_J  47.8,4.34 30 top
BAT_J2  48.74,7.16 30 top
C1  13.89,23.04 90 top
C2  10.24,24.46 90 bottom
C3  9.13,24.46 90 bottom
C4  12.46,23.04 90 top
C5  11.35,23.04 90 top
C6  26.43,22.72 270 bottom
C7  20.4,22.72 270 bottom
C8  49.45,16.37 270 bottom
C9  41.35,9.22 0 bottom
C10  44.21,17 180 top
C11  25.95,16.84 0 bottom
C12  38.65,15.41 180 top
C13  35.64,14.46 0 bottom
C14  35.64,11.29 0 bottom
C15  29.92,13.99 90 bottom
C16  47.07,22.24 180 top
C17  38.97,9.7 90 bottom
C18  41.35,12.4 0 bottom
C19  47.7,22.56 180 bottom
C20  43.89,22.56 0 bottom
C21  49.45,19.7 0 bottom
C22  33.1,17.64 180 bottom
C23  42.62,20.02 90 bottom
C24  47.7,4.78 150 bottom
C25  38.65,18.11 0 top
C26  41.83,21.29 180 top
C27  38.34,20.34 0 top
C28  25.48,20.34 0 bottom
C29  23.57,13.03 90 bottom
C30  50.88,23.19 180 bottom
C31  50.56,16.37 90 bottom
C32  45.64,7.48 330 bottom
D1  14.37,10.02 0 top
D2  40.56,23.67 90 bottom
D3  14.37,19.23 180 top
D4  8.65,24.94 180 top
D5  19.29,18.27 180 bottom
D6  17.86,18.27 180 bottom
D7  20.71,18.27 180 bottom
EXT_TH_J  36.11,6.52 150 top
FB1  8.49,23.35 180 top
J1  50.4,17.32 90 top
PIO_J  36.11,28.11 210 top
Q1  45.16,14.46 180 bottom
R  6.11,20.49 90 top
R1  47.23,17.32 0 bottom
R2  14.37,13.03 270 top
R3  8.97,12.88 90 bottom
R4  47.07,18.11 0 top
R5  47.01,10.12 240 bottom
R6  41.35,10.81 0 bottom
R7  47.07,19.7 0 top
R8  47.07,21.29 180 top
R9  41.35,13.99 0 bottom
R10  41.35,15.73 0 bottom
R11  21.51,20.49 90 top
R12  35.64,15.89 0 bottom
R13  48.34,13.67 270 bottom
R14  41.67,13.99 180 top
R15  33.26,15.26 0 top
R16  33.26,18.43 0 top
R17  33.26,16.84 0 top
R18  35.64,12.4 0 top
R19  35.64,12.88 0 bottom
R20  44.21,16.05 180 top
R21  19.92,20.49 90 top
R22  23.25,20.49 90 top
R23  38.97,6.21 90 bottom
R24  14.37,16.21 90 top
R25  25.48,19.07 180 bottom
R26  33.1,20.81 180 bottom
R27  33.1,19.23 0 bottom
R28  22.3,13.03 90 bottom
R29  44.21,20.02 270 bottom
R30  51.04,11.13 180 bottom
R31  38.65,21.13 0 bottom
R32  38.18,19.23 180 bottom
R33  37.86,23.04 270 bottom
R34  38.34,21.29 0 top
R35  22.78,19.54 180 bottom
R36  20.4,13.99 180 bottom
R37  50.88,24.94 180 bottom
R38  41.03,20.49 270 bottom
R39  26.27,11.92 180 bottom
SJ1  45.8,23.99 0 bottom
SJ2  26.27,9.22 0 bottom
SJ3  22.94,16.84 180 bottom
SWD  6.11,15.41 270 top
TRIMBLE-LOGO1  22.46,12.72 0 top
U1  12.14,18.43 270 bottom
U2  38.49,12.88 270 top
U3  41.83,19.38 180 top
U4  26.75,14.3 0 bottom
U5  46.43,20.49 0 bottom
U6  23.41,22.88 0 bottom
U$1  30.24,17.32 90 top
VBUS_OUT_J  46.11,29.7 150 top
X1  13.09,23.83 90 bottom

### Tracks (layer width: path | path; a pad name or v marks a point on that pad's centre or on a via)
3V3_OUT  (via drill 0.3 pad 0.65, 0.35 pad 0.75)
  Top 0.254: U$1.PAD_PU11 0.75,25.58 0.84,25.5 | U$1.PAD_PU14 45.06,33.84 45.14,33.76 | 56.99,25.5 57.07,25.58 U$1.PAD_PU15 | 15,6.21 15,6.68 | U$1.PAD_PU18 29.94,9.44 29.68,9.44
  Top 0.406: SJ2.1 27.38,9.22 | 29.45,9.22 29.73,9.22 29.89,9.38 U$1.PAD_PU18
  Top 1.27: 29.45,9.22 27.38,9.22 17.54,9.22 15,6.68 | U$1.PAD_PU12 15,31.61 17.38,29.23 | 17.38,29.23 21.54,25.07 28.65,25.07 U$1.PAD_PU13 30.26,25.26 v35.14,25.26 v34.21,25.26 | 17.38,29.23 14.52,26.37 4.2,26.37 | 0.84,25.5 2.35,26.37 4.2,26.37 | 4.2,26.37 4.2,17.61 4.24,17.57 4.24,12.61 2.61,10.98 | 29.68,9.44 29.74,9.47 | U$1.PAD_PU17 40.08,5.72 | 40.08,5.72 36.42,9.38 v32.94,9.38 | v32.94,9.38 29.89,9.38 | 56.99,25.5 55.16,23.67 55.16,11.45 57.07,9.54 | 46.08,33.09 56.43,26.99 57.84,25.58 U$1.PAD_PU15 | 45.14,33.76 46.27,33.09 46.08,33.09 | 46.08,33.09 44.11,33.09 40.56,29.54 40.56,29.38 v37.07,25.89 | 40.08,5.72 41.82,5.72 v45.32,9.22 | U$1.PAD_PU18 32.75,9.57 v32.94,9.38 | 57.07,9.54 v51.83,9.54 | U$1.PAD_PU16 57.55,9.06 57.07,9.54 | U$1.PAD_PU20 2.61,10.98 | U$1.PAD_PU19 15,6.21 12.94,6.21 10.87,8.27 5.32,8.27 2.61,10.98
  Route2 1.27: v42.94,7 v45.32,9.22 46.19,10.09 49.11,10.09 49.29,9.91 v49.29,9.54 v51.83,9.54 | v34.84,9.38 v32.94,9.38 31.35,9.38 29.6,11.13 v29.6,14.46 v28.34,14.46
  Bottom 1.27: 34.22,25.23 34.27,25.26 v35.14,25.26 36.43,25.26 v37.07,25.89 v37.86,26.69
  other vias: 27.03,9.22
  pour Bottom (no thermals): 30.72,13.99 27.86,13.99 27.86,15.57 30.72,15.57
3V3_OUT_EN  (via drill 0.25 pad 0.55)
  Top 0.203: v15.48,14.78 v17,14.78
  Bottom 0.203: U1.24 15.52,14.83 v15.48,14.78 | v17,14.78 18.75,14.78 R36.1
3V3_OUT_PG  (via drill 0.25 pad 0.55)
  Top 0.203: v15.58,13.19 v17,13.19
  Bottom 0.203: U4.4 25.25,13.04 25.23,13.02 17.16,13.02 v17,13.19 | U1.25 14.89,13.88 v15.58,13.19
  Bottom 0.406: U4.4 25.25,12.1 R39.1
CHARGER_CURRENT_SENSE  (via drill 0.3 pad 0.65)
  Top 0.254: U3.1 43.36,18.15 C10.2 R20.2
  Top 0.305: v42.62,17.95 42.88,18.21 U3.1
  Route15 0.305: v16.85,18.31 18,17.16 34.05,17.16 34.84,17.95 v42.62,17.95
  Bottom 0.305: U1.19 16.72,18.18 v16.85,18.31
CHARGER_DETECT  (via drill 0.25 pad 0.55)
  Top 0.254: U3.7 v39.98,19.13
  Route15 0.254: v19.29,17.95 23.25,17.95 25.79,20.49 38.62,20.49 v39.98,19.13
  Bottom 0.254: R38.2 40.5,19.64 v39.98,19.13 | D5.2 v19.29,17.95
CLK
  Top 0.203: SWD.1 SWD.2
  Bottom 0.203: SWD.2 8.02,15.41 8.97,14.46 R3.2 9.39,14.15 U1.36
DATA
  Bottom 0.203: U1.35 9.89,13.23 9.54,12.88 SWD.3
GND  (via drill 0.3 pad 0.65, 0.35 pad 0.75)
  Top 0.254: U2.A2 39.74,13.38 39.76,13.36 | U3.4 41.87,20.13 41.83,20.18
  Top 0.305: U3.4 44.01,20.13 44.05,20.18 | J1.B1 53.22,19.82 53.26,19.86 | J1.B1 50.6,19.82 50.35,20.07 J1.A12 | J1.A12 49.74,20.52 49.45,20.81 | J1.A12 49.74,20.23 49.47,20.49 49.13,20.49 | J1.B1 51.51,19.89 51.51,20.02 51.51,20.49 | J1.A1 50.61,14.57 50.86,14.32 J1.B12 | J1.A1 48.71,14.57 48.5,14.78 | J1.B12 51.83,14.32 | 51.83,14.32 52.61,14.32 52.62,14.3 | J1.B12 51.44,13.4 J1.S1 51.65,14.14 51.83,14.32 | J1.A1 49.74,13.96 49.45,13.67
  Top 0.406: C6.2
  Top 0.508: D4.1 10.39,24.94 C5.2 | C4.2 C1.2 16.06,23.88 16.11,23.83 | J1.S2 51.65,20.16 51.51,20.02 | 50.61,14.57 50.31,14.57 50.26,14.52 49.22,14.52 49.17,14.57 48.71,14.57 | 53.26,14.3 51.99,14.3 51.96,14.27 50.91,14.27 50.86,14.32
  Top 0.61: C26.1 41.83,20.44 41.83,20.18 U3.9 41.83,17.48 41.67,17.32
  Top 1.27: 43.1,27.16 43.1,28.81 VBUS_OUT_J.2 44.25,30.06 45.48,31.29 | J1.S3 J1.S4 | J1.S2 51.65,22.7 51.67,22.72 | J1.S1 51.67,13.17 51.67,11.76 | BAT_J.2 45,5.56 45,5.57 | BAT_J2.2 45.31,6.99 46.11,7.79
  Route2 1.27: BAT_J2.2 44.59,4.46 42.78,4.46 | BAT_J2.2 46.43,6.3 46.43,7.48 | BAT_J.2 45.38,5.18 BAT_J2.2 | VBUS_OUT_J.2 43.48,29.96 42.46,30.97 | VBUS_OUT_J.2 44.05,30.16 44.05,31.45 | VBUS_OUT_J.2 44.62,30.34 45.64,30.34 | VBUS_OUT_J.2 44.37,29.84 44.37,27.96 | VBUS_OUT_J.2 43.35,29.07 43.26,29.07 | VBUS_OUT_J.2 44.9,29.96 45.64,29.23 | EXT_TH_J.2 34.07,7.95 35.32,7.95 | 32.46,26.05 33.12,26.05 PIO_J.2 35.03,26.84 35.26,26.62 35.71,26.62 35.95,26.37 | J1.S1 53.89,13.19 | J1.S4 56.32,12.83 56.27,12.88 | 57.54,22.88 57.54,21.87 J1.S3 57.6,21.19 57.54,21.13 | 51.67,22.88 51.65,22.86 J1.S2 51.67,21.43 51.67,20.49 | J1.S1 51.44,13.19 51.08,12.83 | J1.S4 57.65,12.88 58.5,12.88 | J1.S4 57.86,12.57 57.86,12.08 | J1.S1 51.65,13.97 51.67,13.99 | J1.S1 51.83,13.01 51.83,12.4
  Route15 1.27: 30.72,23.83 33.73,26.84 PIO_J.2 35.03,26.84 35.14,26.73 35.27,26.73 35.64,26.37 | VBUS_OUT_J.2 42.94,28.65 42.94,27.48 | VBUS_OUT_J.2 45.64,31.35 45.64,31.93 | J1.S4 57.49,12.72 55.64,12.72 | J1.S3 57.54,21.75 57.54,19.38 | J1.S2 51.81,21.61 54.21,21.61 | J1.S1 54.21,13.19 | 44.53,7.32 44.53,5.97 BAT_J2.2 43.95,3.83 43.1,3.83 | 37.38,9.22 36.35,8.19 35.42,8.19 35.03,7.79 EXT_TH_J.2 34.39,8.27 35.31,8.27 35.96,8.92 35.96,9.84 35.31,10.5 33.89,10.5 33.57,10.81 | BAT_J.2 46.25,2.4 45.16,2.4 | VBUS_OUT_J.2 43.39,30.81 43.1,30.81 | VBUS_OUT_J.2 42.36,29.96 42.31,30.02 | VBUS_OUT_J.2 44.25,31.33 44.37,31.45 | VBUS_OUT_J.2 44.53,29.68 44.53,27.96 | VBUS_OUT_J.2 44.35,29.86 45.96,29.86 | J1.S3 56.91,22.5 56.91,22.72 | J1.S3 57.6,21.98 58.18,22.56 | J1.S2 51.99,21.11 51.99,20.65 | J1.S2 51.51,21.45 50.88,22.08 | J1.S2 51.51,21.31 51.51,20.81
  Bottom 0.254: U1.7 12.39,18.68 U1.49 v12.46,18.11
  Bottom 0.305: U5.4 47.54,19.74 47.74,19.54 47.74,19.07 47.92,18.9 49.27,18.9 49.29,18.91 49.93,18.91 50.3,19.28 C21.1
  Bottom 0.406: 42.82,22.56 C20.2 | C8.2 48.55,14.52 R13.1 | 23.1,22.88 U6.2 25.32,22.88 25.53,22.66 25.54,22.66 C6.2
  Bottom 0.508: C9.1 42.36,9.38 43.73,9.38
  Bottom 0.61: U4.3 27.38,13.35 v27.22,13.51 | U4.3 29.39,13.35 29.6,13.14 | v28.34,12.88 28.25,12.96 U4.3 | 29.6,13.14 31.25,13.14 31.35,13.03 | 29.6,13.14 29.6,11.92 29.45,11.76 | 22.3,10.81 R28.1 20.98,12.18 20.87,12.08 | 23.57,12.34 23.57,10.49 | 26.96,16.53 27.22,16.27 v27.22,14.3 | 26.96,16.53 26.96,15.79 v26.27,15.1 | 26.96,16.53 28.97,16.53 | C7.2 v18.84,21.77
  Bottom 1.27: PIO_J.2 33.17,26.84 30.61,25.37 30.55,25.26 30.32,25.2 30.21,25.09 30.09,25.09 U$1.PAD_PD13 30.08,22.72 | C24.1 47.21,4.11 BAT_J.2 | BAT_J.2 45.16,1.31 45.16,1.29 | BAT_J2.2 47.14,3.36 BAT_J.2 | BAT_J2.2 43.79,3.67 42.94,3.67 | C32.2 45.31,6.51 BAT_J2.2 | U$1.PAD_PD12 15,31.13 14.68,30.81 | U$1.PAD_PD11 2.14,25.58 3.57,24.15 | U$1.PAD_PD20 1.03,9.06 3.09,11.13 | U$1.PAD_PD19 15,3.67 15.16,3.83 | U$1.PAD_PD18 30.07,12.67 29.6,13.14 | U$1.PAD_PD16 58.18,9.06 56.43,10.81 | U$1.PAD_PD15 58.03,25.58 56.59,24.15 | C21.1 52.25,19.7 52.28,19.73 | J1.S2 53.57,21.45 53.73,21.29 | J1.S3 56.07,21.81 55.96,21.92 | J1.S4 57.6,14.84 57.7,14.94 | J1.S1 51.81,13.35 53.58,13.35 | C19.2 48.65,24.46 48.66,24.46 | C20.2 42.94,24.78 | C31.1 51.67,14.41 51.67,14.3 | VBUS_OUT_J.2 41.73,29.96 41.35,30.34 | VBUS_OUT_J.2 45.1,30.81 | 45.1,30.81 46.43,30.81 | U$1.PAD_PD14 45.1,33.74 45.1,30.81 | VBUS_OUT_J.2 44.25,28.63 43.89,28.27 | VBUS_OUT_J.2 44.25,29.58 43.26,28.59 | VBUS_OUT_J.2 43.73,30.47 43.73,31.29 | VBUS_OUT_J.2 44.9,29.96 45.48,29.38 | VBUS_OUT_J.2 45,29.2 45,29.07 | VBUS_OUT_J.2 44.25,31.01 44.37,31.13 | 35.95,8.43 35.49,7.96 35.2,7.96 35.03,7.79 EXT_TH_J.2
  other vias: 37.33,19.23 12.62,31.93 12.78,30.18 17.54,30.97 18.81,30.81 1.66,21.45 2.93,22.88 4.84,27.8 5.95,23.99 1.19,13.35 5.32,10.81 6.75,9.7 4.05,7.48 17.86,4.14 12.3,3.98 11.67,5.57 14.21,7.64 32.14,10.81 28.02,10.81 31.67,13.51 27.22,15.1 26.27,14.3 26.27,13.51 22.3,12.24 23.57,12.08 10.4,19.54 26.43,21.77 37.7,9.86
  pour Top (rank 2): 60.09,34.77 60.09,8.59 50.63,2.92 45.19,0.02 -0.07,0.02 0.07,34.79
  pour Bottom (rank 2): 60.09,34.77 60.09,8.91 59.79,8.61 59.78,8.61 47.24,1.09 47.24,1.09 44.65,0.02 -0.07,0.02 0.07,34.79
  pour Route15 (rank 2): 60.09,34.77 60.09,8.75 54.94,5.31 45.04,0.02 45.04,0.02 -0.07,0.02 0.07,34.79
  pour Route2 (rank 2): 60.09,34.77 60.09,8.59 60.08,8.59 52.58,4.09 45.46,0.29 44.81,0.02 -0.07,0.02 0.07,34.79
IND_LED  (via drill 0.25 pad 0.55)
  Top 0.254: R2.1
  Bottom 0.254: U1.27 13.89,14.66 14,14.55 14,14.24 R2.1
  other vias: 14.36,13.88
MCU_3V3  (via drill 0.3 pad 0.65, 0.35 pad 0.75)
  Top 0.406: R22.2 R11.2 R21.2 20.4,21.82 C7.1
  Top 0.508: D4.2 v7.55,24.3 7.55,23.44 FB1.2
  Route2 0.406: R39.2 25.69,11.92 20.4,17.22 C7.1
  Route2 0.508: v7.55,24.3 19.76,24.3 C7.1
  Route15 0.305: R39.2 31.99,11.92 36.27,16.21 43.57,16.21 47.07,19.7 v48.89,19.7
  Bottom 0.305: U5.3 48,20.24 48.55,19.7 C21.2 v48.89,19.7
  Bottom 0.406: SJ2.2 25.51,10.31 R39.2 | U6.5 20.54,23.53 C7.1
  other vias: 27.12,11.92 20.4,23.67
MCU_INT  (via drill 0.25 pad 0.55)
  Top 0.203: R16.1 32.16,18.19 24.08,18.19 23.25,19.01 R22.1 23.21,19.64 v22.34,20.52
  Top 0.254: R16.1 36.11,22.14 PIO_J.1
  Bottom 0.203: v22.34,20.52 22.16,20.35 16.68,20.35 16.01,19.68 U1.16
MCU_LDO_EN
  Bottom 0.203: D6.2 17.8,17.18 U1.21
MCU_SCL  (via drill 0.25 pad 0.55)
  Top 0.203: R15.1 28.63,15.26 26.72,17.16 21.32,17.16 19.88,18.6 19.88,19.61 | R21.1 19.88,19.61 | v16.98,19.07 19.34,19.07 19.88,19.61
  Bottom 0.203: U1.18 16.24,18.68 16.45,18.89 16.8,18.89 v16.98,19.07
MCU_SDA  (via drill 0.25 pad 0.55)
  Top 0.203: R17.1 28.44,16.84 27.64,17.64 22.14,17.64 21.51,18.27 21.51,19.54 | 21.51,19.54 R11.1 | v16.82,19.74 18.61,19.74 19.27,20.4 20.65,20.4 21.51,19.54
  Bottom 0.203: U1.17 16.24,19.18 16.65,19.59 16.67,19.59 v16.82,19.74
N$1
  Top 0.254: R2.2 D1.A
N$3
  Top 0.254: R24.2 D3.A
N$4
  Bottom 0.254: C30.2 51.72,23.19 49.27,20.74 49.15,20.74
  Bottom 0.305: U5.2 49.15,20.74
  Bottom 0.61: R37.2 51.73,23.29 C30.2
N$5
  Bottom 0.254: U1.9 13.39,22.7 14.29,23.6 X1.P$1
N$6
  Bottom 0.254: X1.P$3 11.9,23.73 12.89,22.74 U1.8
N$7  (via drill 0.2 pad 0.13)
  Bottom 0.254: R19.1 37.08,13.48 38.35,13.48 38.45,13.38 U2.B2
  other vias: 38.49,13.38
N$8  (via drill 0.25 pad 0.55)
  Top 0.203: R.1 6.59,20.97 13.04,20.97 14.19,22.13 v13.95,22.38 | C1.1 14.06,22.07 13.86,21.98
  Top 0.254: C1.1 13.95,22.24 v13.95,22.38
  Bottom 0.203: U1.10 13.89,22.32 v13.95,22.38
N$9  (via drill 0.25)
  Top 0.254: v37.43,14.33 37.43,13.62 37.57,13.48 37.72,13.48 37.82,13.38 U2.C2
  Bottom 0.254: v37.43,14.33 38.63,14.33 39.13,13.83 40.34,13.83 40.5,13.67 C18.2
  Bottom 0.406: R9.2 C18.2
N$10
  Bottom 0.406: Q1.4 42.5,15.44 R10.1
N$11  (via drill 0.25)
  Top 0.254: v39.6,12.88 U2.A3
  Bottom 0.254: R6.2 40.33,10.81 39.6,11.54 v39.6,12.88
  Bottom 0.406: C9.2 R6.2
N$12
  Bottom 0.254: C18.1 43.25,11.35 R5.1
  Bottom 0.406: R6.1 C18.1
  pour Bottom (no thermals): 47.54,11.13 45.96,10.18 44.84,11.98 44.84,14.3 47.07,14.3 47.07,11.92
N$13
  pour Bottom (no thermals): 44.53,13.83 43.1,13.83 43.1,15.1 44.53,15.1
N$14
  Top 0.254: U3.2 45.2,19.13 R4.1
  Top 0.813: R4.1 45.11,17 C10.1 R20.1
N$15  (via drill 0.2, 0.2 pad 0.13)
  Top 0.305: v34.9,18.59 34.27,18.59 R16.2
  Route2 0.254: v38.49,12.38 38.34,12.22 37.07,12.22 34.58,14.7 34.58,18.27 v34.9,18.59
N$16
  Top 0.254: U2.B5 38.49,11.45 37.54,10.49 33.57,10.49 33.26,10.81 33.26,16.21 33.89,16.84 R17.2
N$17  (via drill 0.2 pad 0.13, 0.25 pad 0.65)
  Route2 0.254: U2.B3 38.76,12.88 39.4,12.24 40.4,12.24 41.67,13.51 47.65,13.51 R13.2
  Bottom 0.254: R13.2 48.5,12.82 R30.1
  other vias: 38.49,12.88 48.34,12.82
N$18  (via drill 0.3 pad 0.65)
  Top 0.254: U2.C3 v37.46,12.88
  Route2 0.254: v40.56,15.17 39.2,15.17 37.46,13.43 v37.46,12.88
  Bottom 0.254: R10.2 40.56,15.68 v40.56,15.17
N$19  (via drill 0.25 pad 0.55)
  Top 0.254: v38.97,11.13 38.97,11.85 U2.A5
  Bottom 0.254: C17.2 38.68,10.84 v38.97,11.13
N$20
  Top 0.254: U2.B1 38.49,14.41 C12.1
N$21  (via drill 0.25 pad 0.55)
  Top 0.254: U2.C1 37.99,15.22 C12.2
  Bottom 0.254: R12.1 37.33,15.89 C12.2
  Bottom 0.406: R12.1 C13.1
  other vias: 37.8,15.41
N$22
  Bottom 0.406: R35.2 24.11,19.07 R25.1 24.63,20.49 24.36,20.76 U6.3
  Bottom 0.61: C28.2 23.73,19.54 R35.2
N$23
  Bottom 0.305: U5.5 45.22,19.74 44.64,19.17 R29.2
N$24
  Top 0.254: R15.2 33.73,14.88 33.73,11.13 33.89,10.97 37.09,10.97 U2.C5
N$25
  Bottom 0.406: Q1.1 42.98,13.49 42.49,13.99 R9.1
N$26  (via drill 0.25 pad 0.55)
  Top 0.254: R18.2 36.59,12.4 | U2.C4 37.88,12.28 37.83,12.28 37.82,12.27 36.74,12.27 36.61,12.4 36.59,12.4 | v36.59,11.76 36.59,12.4
  Bottom 0.254: C14.1 36.59,11.39 v36.59,11.76
N$27
  Top 0.254: U3.3 46.15,19.63
  Top 0.813: C16.2 R8.2 R7.1 46.15,19.63
N$28  (via drill 0.3 pad 0.65)
  Top 0.254: U2.A1 40.71,13.88 R14.2 39.98,13.99 v39.53,14.44
  Route15 0.254: v39.53,14.44 40.88,13.09 40.88,9.06 38.34,6.52 EXT_TH_J.1
  Bottom 0.254: EXT_TH_J.1 37.8,6.52 R23.1
N$29
  Bottom 0.305: U5.6 45.07,20.24 44.89,20.06 43.43,20.06 C23.2
N$30
  Bottom 0.406: U4.5 23.99,14.3 23.57,13.88 R28.2 21.35,13.88 R36.2
  Bottom 0.61: C29.2 23.47,13.88 R28.2
N$32
  Bottom 0.406: D6.1 D5.1 D7.1 21.81,19.42 R35.1
N$35
  Bottom 0.406: D7.2 20.99,16.84 SJ3.1
STATUS_LED  (via drill 0.25 pad 0.55)
  Top 0.254: R24.1 13.3,14.3 v13.25,14.3
  Bottom 0.254: v13.25,14.3 13.39,14.44 U1.28
USART1_RX
  Bottom 0.203: U$1.PAD_PD4 11.39,8.47 U1.32
USART1_TX  (via drill 0.25 pad 0.55)
  Top 0.203: v9.98,6.32 8.6,4.93 U$1.PAD_PU4
  Bottom 0.203: v9.98,6.32 11.82,8.15 11.82,13.63 12.89,14.7 U1.29
USART2_RX
  Bottom 0.203: U$1.PAD_PD2 16.27,23.83 16.27,21.13 15.82,20.68 U1.14
USART2_TX  (via drill 0.25 pad 0.55)
  Top 0.203: v19.7,28.55 20.86,29.71 U$1.PAD_PU2
  Bottom 0.203: U1.13 15.68,21.18 15.84,21.34 15.84,24.05 19.7,27.91 v19.7,28.55
USART3_RX
  Bottom 0.203: U1.23 15.82,16.18 16.11,15.89 16.11,10.97 U$1.PAD_PD3
USART3_TX  (via drill 0.25 pad 0.55)
  Top 0.203: v20.88,7.21 22.15,5.94 U$1.PAD_PU3
  Bottom 0.203: U1.22 15.96,16.68 16.47,16.17 16.47,11.25 20.5,7.21 v20.88,7.21
USART4_RX
  Bottom 0.203: U1.12 14.89,22.07 15.36,22.53 15.36,25.03 10.68,29.71 U$1.PAD_PD1
USART4_TX  (via drill 0.25 pad 0.55)
  Top 0.203: v10.46,29.15 8.41,29.15 U$1.PAD_PU1
  Bottom 0.203: U1.11 14.39,22.07 15,22.68 15,24.77 10.62,29.15 v10.46,29.15
USART6_RX
  Bottom 0.203: U1.48 8.23,21.18 6.53,19.48 4.78,19.48 2.62,17.32 U$1.PAD_PD5
USART6_TX  (via drill 0.25 pad 0.55)
  Top 0.203: v3.18,17.13 0.88,17.13 U$1.PAD_PU5
  Bottom 0.203: U1.47 8.4,20.68 6.84,19.12 5.16,19.12 3.18,17.14 v3.18,17.13
VBAT  (via drill 0.35 pad 0.75)
  Top 0.254: U2.A4 39.15,12.38 41.38,10.15 46.45,10.15 R5.2
  Bottom 0.254: C32.1 46.46,8.24 46.27,8.43 40.34,8.43 R23.2 35.6,10.43 35.6,10.65 35.62,10.67 35.62,15.08 35.45,15.24 35.44,15.24 R12.2 35.11,15.89
  other vias: 47.72,8.89
  pour Bottom (no thermals): 48.81,3.35 46.91,6.52 46.27,7 45.48,8.27 48.18,9.86 50.24,7.48 50.08,4.14
VBUS  (via drill 0.3 pad 0.6, 0.35 pad 0.75)
  Top 0.254: v46.53,17.08 46.69,17.08 47.72,18.11 R4.2
  Top 0.406: R18.1 35.2,12.81 35.2,16.89 v35.32,17
  Route2 0.254: 35.64,23.51 35.16,23.99
  Route2 0.406: 35.64,23.51 35.64,17.32 v35.32,17
  Route2 1.27: SJ1.1 35.16,23.99 26.75,23.99 C6.1 25.26,22.5 v25.26,16.53
  Bottom 0.254: R1.2 46.3,17.32 v46.53,17.08 | R30.2 49.28,13.74 47.67,13.74 47.51,13.9 47.51,14.47 47.19,14.79 Q1.6
  Bottom 0.406: v35.32,17 35.48,17.16 35.48,19.28 R26.2 37.49,20.81 R31.2 | U6.1 26.29,23.53 C6.1
  Bottom 0.813: R31.2 37.8,22.13 R33.2
  other vias: 26.43,23.67 46.56,23.99
  pour Bottom (no thermals): 47.23,14.62 44.84,14.62 44.84,18.38 46.03,19.57 46.03,24.78 47.38,24.78 47.38,21.77 47.7,21.45 47.7,20.97 47.07,20.97
  pour Bottom (no thermals): 23.1,17.64 23.1,15.1 25.64,15.1 25.79,15.26 25.79,17.64
VBUS1  (via drill 0.35 pad 0.75)
  Top 0.254: C26.2 40.98,20.33 U3.5
  Top 0.406: R38.1 C26.2
  Bottom 0.406: R38.1 40.82,21.13 R31.1 39.03,20.65 R32.2
  other vias: 41.03,21.34
VBUS2  (via drill 0.35 pad 0.75)
  Top 0.254: U3.6 40.3,19.63 39.55,20.38 | 39.55,20.38 39.39,20.54 C27.2 | 39.55,20.38 39.59,20.43 39.59,20.88 R34.2
  Top 0.406: R34.2 39.41,21.51 D2.1
  Bottom 0.406: R33.1 39.35,23.88 39.41,23.83
  Bottom 0.813: D2.2 39.41,23.83 D2.1
  other vias: 39.41,22.72
VBUS_OUT
  Bottom 0.813: SJ1.2 45.04,22.75 C20.1
  pour Bottom (no thermals): 45.77,20.34 43.58,20.34 43.58,21.45 44.05,21.92 44.05,25.17 44.12,25.41 46.91,30.02 48.97,28.75 47.54,26.25 45.77,24.92
VBUS_OUT_EN  (via drill 0.25 pad 0.55)
  Route15 0.254: v50.03,24.78 39.92,24.78 37.83,22.69 18.58,22.69 v16.76,20.88
  Bottom 0.254: U1.15 15.91,20.18 16.6,20.88 v16.76,20.88
  Bottom 0.61: R37.1 v50.03,24.78
VBUS_SENSE
  Bottom 0.305: U1.20 17.11,17.68 18.02,18.59 19.6,18.59 20.08,18.11 31.99,18.11 32.25,18.38
  Bottom 0.406: R26.1 R27.2 | 32.25,18.38 C22.1
  Bottom 0.61: R27.2 C22.1
VCHARGER  (via drill 0.3 pad 0.6, 0.3 pad 0.65, 0.35 pad 0.75)
  Top 0.254: R7.2 48.97,18.65 48.97,17.64 48.34,17 v47.86,17
  Top 0.305: v39.61,17.32 39.5,17.42 C25.2 40.3,18.11 40.34,18.16 40.34,18.2 U3.8
  Route2 0.305: v39.61,17.32 40.56,16.37 47.23,16.37 v47.86,17
  other vias: 52.78,18.59 52.78,17.32 52.78,16.21 50.56,17.16 48.9,18.27 50.56,18.43
  pour Top (no thermals): 53.42,15.57 48.5,15.57 48.5,19.23 53.42,19.23
  pour Bottom (no thermals): 53.42,15.57 47.54,15.57 47.54,19.23 53.42,19.23
VDDA  (via drill 0.35 pad 0.75)
  Top 0.508: FB1.1 9.29,23.35 C3.1
  Bottom 0.254: C2.1 10.68,23.17 11.12,23.17 11.89,22.4 U1.6
  Bottom 0.61: C2.1 10.14,23.51 C3.1
  other vias: 9.13,23.51
VREF  (via drill 0.3 pad 0.65)
  Top 0.254: v10.87,22.56 C5.1
  Top 0.61: C4.1 12.36,22.09 C5.1
  Bottom 0.254: v10.87,22.56 11.07,22.37 11.13,22.37 11.39,22.11 U1.5

### Text on the board
tPlace: 3V3/1A | GND | 3V3/1A | 3V3/1A | P1 | P2* | Vbus_Out | +Vbus | Charger_IN | 3V3/1A | R | P5 | C | STAT | BAT_INPUT | D | 3V3/1A | 3V3/1A | BAT_P | 3V3/1A | P3 | P4* | 3V3/1A | BAT_N
bPlace: 10A Max | 5.5 V MAX | H05R01 | 4.9V Max
tNames: B
bNames: GND | P1 | P2* | GND | GND | GND | P5 | GND | GND | GND | P3 | P4* | GND